# Altium project PROC114E3_SCH.PrjPcb (part 20 of 22)

## Sheet 40.SchDoc
size 513 x 386 mm
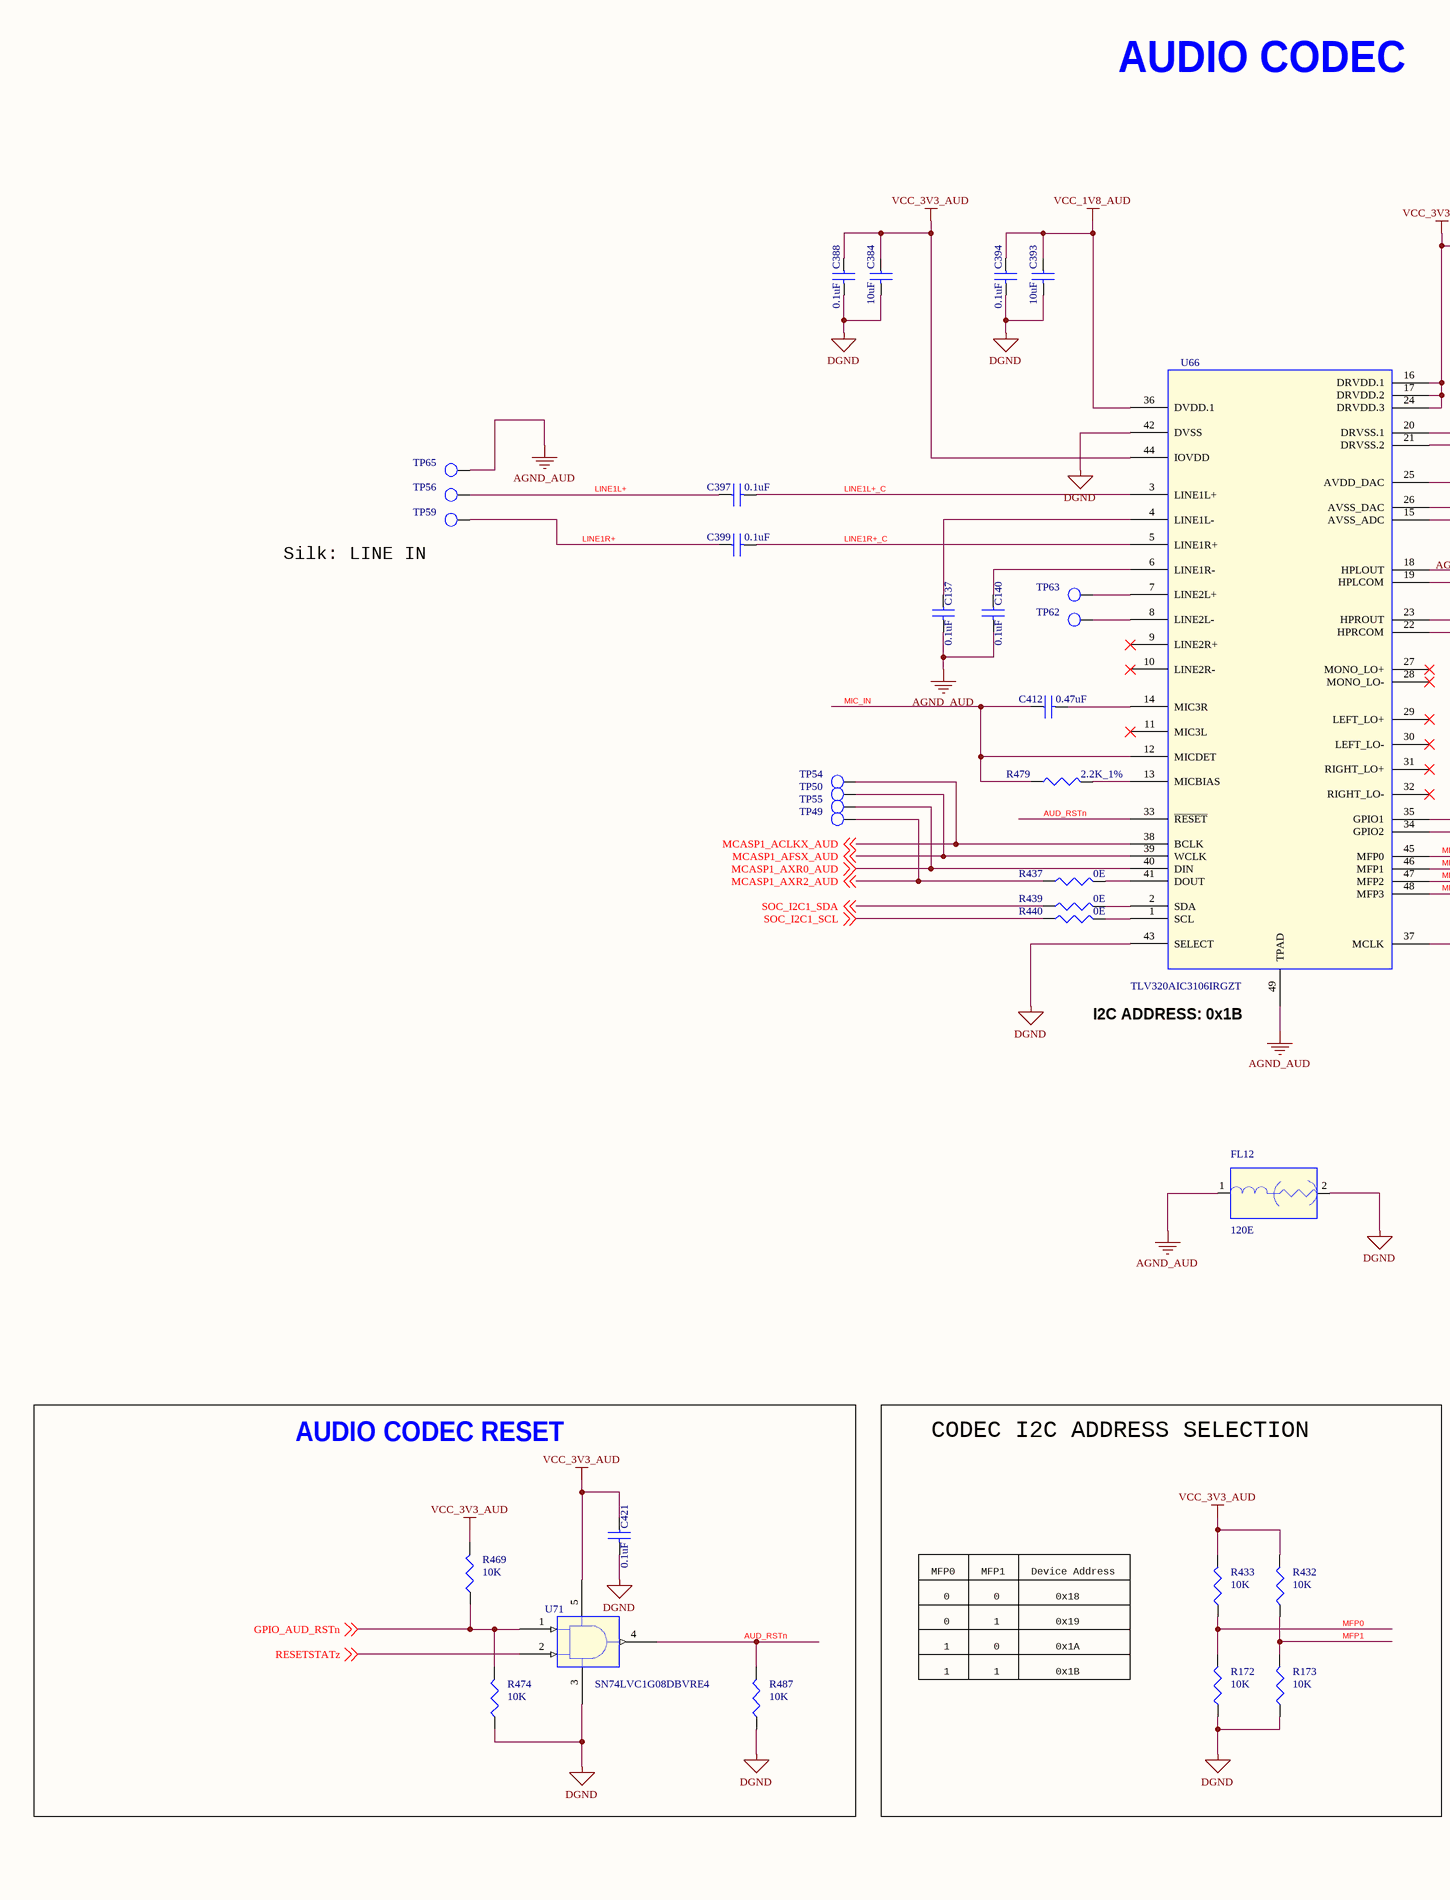
[diagram p71: 40.SchDoc, left]
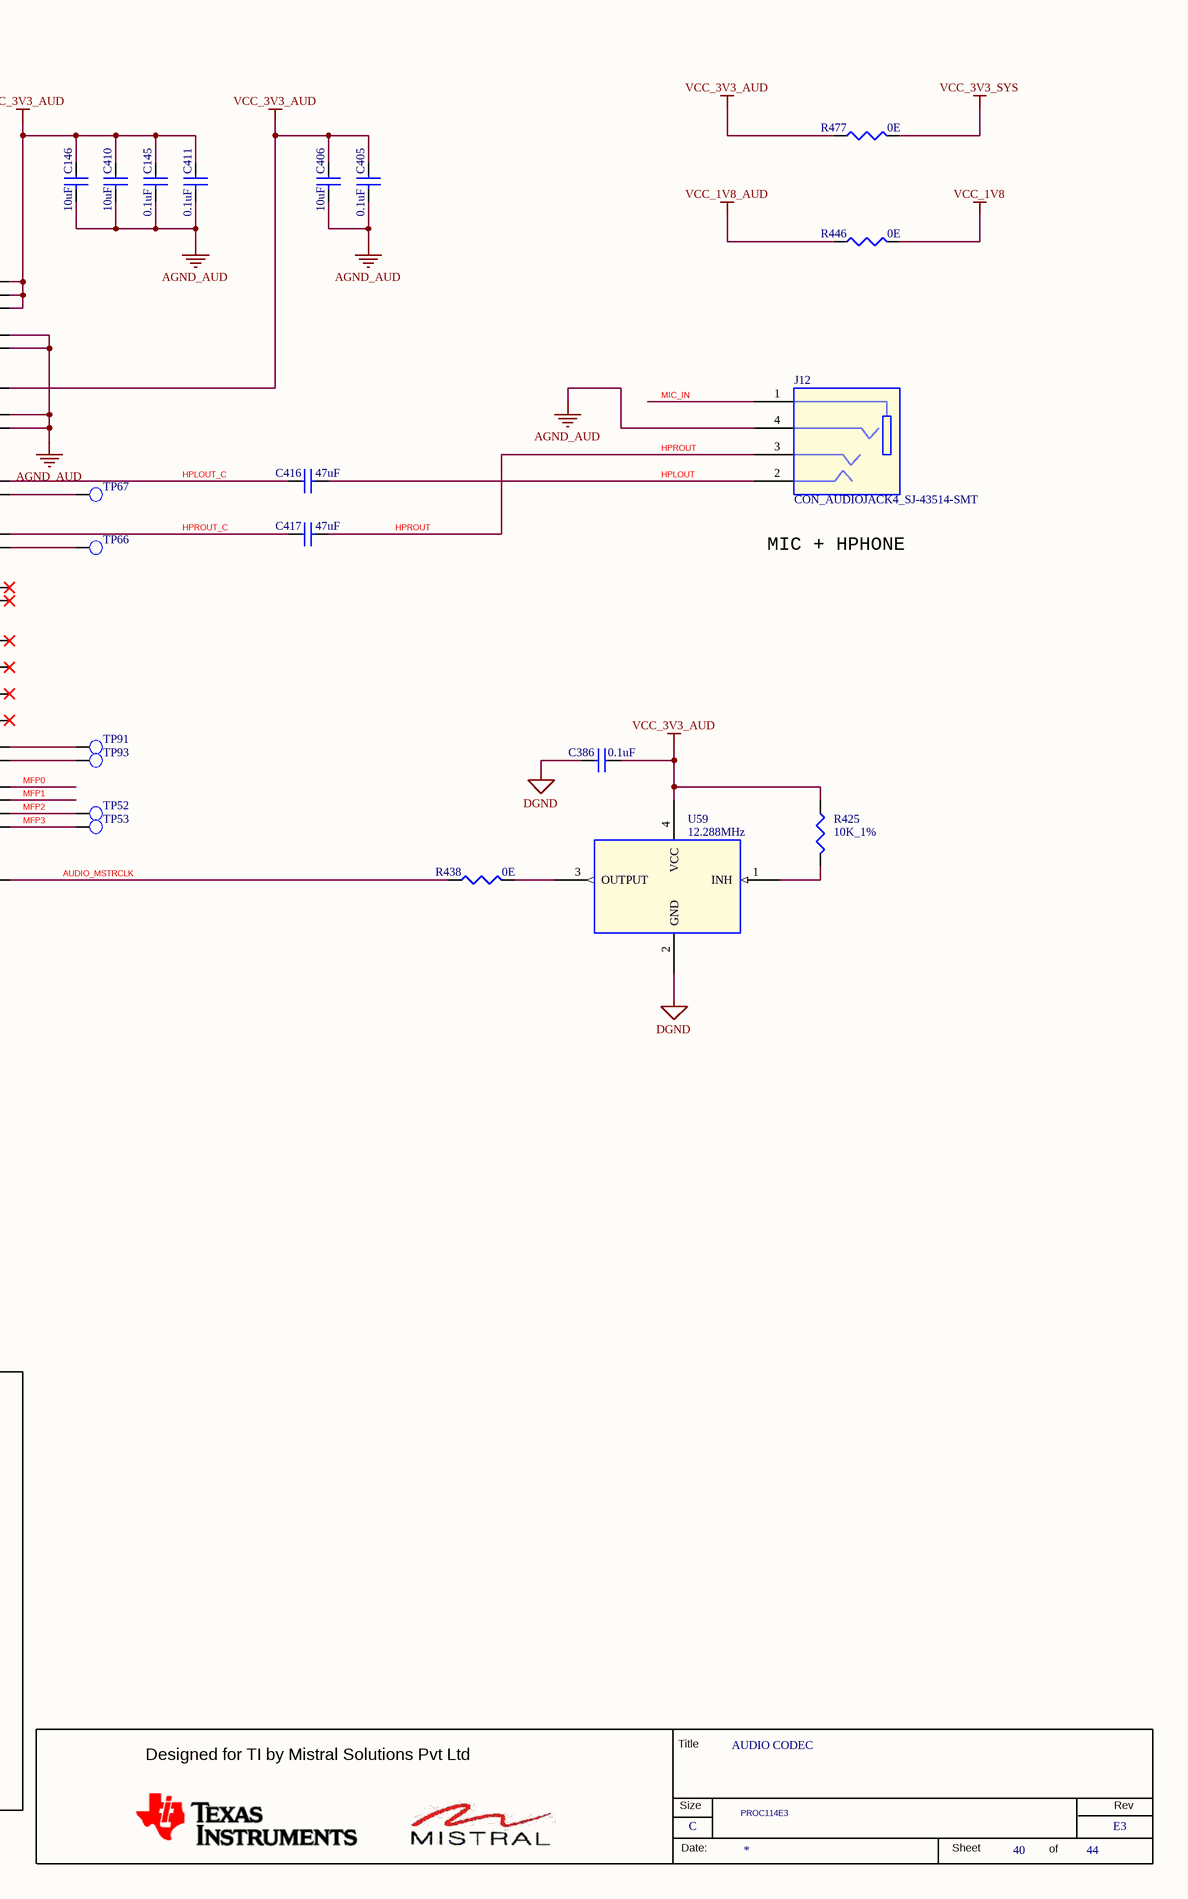
[diagram p72: 40.SchDoc, right]

### Parts
(Parts that share a designator on the sheet are numbered #1, #2 ... from top to bottom, then left to right.)
*#40  RevCode: E3  Title: AUDIO CODEC  Page Size: C  Page Number: 40  Page Count: 44  Variant Name: PROC114E3  (hidden comment: MISTRAL_TITLEBLK_CSIZE)  (graphical)
C137  0.1uF  [CAP0201_0-5]
C140  0.1uF  [CAP0201_0-5]
C145  0.1uF  [CAP0201_0-5]
C146  10uF  [CAP0402_0-75]
C384  10uF  [CAP0402_0-75]
C386  0.1uF  [CAP0201_0-5]
C388  0.1uF  [CAP0201_0-5]
C393  10uF  [CAP0402_0-75]
C394  0.1uF  [CAP0201_0-5]
C397  0.1uF  [CAP0402_0-75]
C399  0.1uF  [CAP0402_0-75]
C405  0.1uF  [CAP0201_0-5]
C406  10uF  [CAP0402_0-75]
C410  10uF  [CAP0402_0-75]
C411  0.1uF  [CAP0201_0-5]
C412  0.47uF  [CAP0402_0-75]
C416  47uF  [CAP1206_2]
C417  47uF  [CAP1206_2]
C421  0.1uF  [CAP0402_0-75]
FL12  120E  [EMIFIL_BLM15A_0402_0-6]
J12  CON_AUDIOJACK4_SJ-43514-SMT  [CON_AV4_SJ-43514-SMT_S_R_S_5-1]
R172  10K  [RES0201_0-5]
R173  10K  [RES0201_0-5]
R425  10K_1%  [RES0201_0-5]
R432  10K  [RES0201_0-5]
R433  10K  [RES0201_0-5]
R437  0E  [RES0201_0-5]
R438  0E  [RES0201_0-5]
R439  0E  [RES0201_0-5]
R440  0E  [RES0201_0-5]
R446  0E  [RES0201_0-5]
R469  10K  [RES0201_0-5]
R474  10K  [RES0201_0-5]
R477  0E  [RES0201_0-5]
R479  2.2K_1%  [RES0201_0-5]
R487  10K  [RES0201_0-5]
TP49  TP20_SMD  [TP20_SMD]  (value not drawn)
TP50  TP20_SMD  [TP20_SMD]  (value not drawn)
TP52  TP20_SMD  [TP20_SMD]  (value not drawn)
TP53  TP20_SMD  [TP20_SMD]  (value not drawn)
TP54  TP20_SMD  [TP20_SMD]  (value not drawn)
TP55  TP20_SMD  [TP20_SMD]  (value not drawn)
TP56  THRU HOLE  [TP_40X65]  (value not drawn)
TP59  THRU HOLE  [TP_40X65]  (value not drawn)
TP62  TP20_SMD  [TP20_SMD]  (value not drawn)
TP63  TP20_SMD  [TP20_SMD]  (value not drawn)
TP65  THRU HOLE  [TP_40X65]  (value not drawn)
TP66  TP20_SMD  [TP20_SMD]  (value not drawn)
TP67  TP20_SMD  [TP20_SMD]  (value not drawn)
TP91  TP20_SMD  [TP20_SMD]  (value not drawn)
TP93  TP20_SMD  [TP20_SMD]  (value not drawn)
U59  12.288MHz  [OSC4_KC2520B_100X80_SMD_0-8]
U66  TLV320AIC3106IRGZT  [VQFN48_19-68_285X285]
U71  SN74LVC1G08DBVRE4  [SOT23-5]

### Blocks framed on the sheet
AUDIO CODEC RESET: C421 R469 R474 R487 U71
CODEC I2C ADDRESS SELECTION: R172 R173 R432 R433

### Nets
AGND_AUD: C137.2 C140.2 C145.2 C146.2 C405.2 C406.2 C410.2 C411.2 FL12.1 J12.4 TP65.1(TP) U66.15(AVSS_ADC) U66.20(DRVSS.1) U66.21(DRVSS.2) U66.26(AVSS_DAC) U66.49(TPAD)
DGND: C384.2 C386.2 C388.2 C393.2 C394.2 C421.2 FL12.2 R172.2 R173.2 R474.1 R487.1 U59.2(GND) U66.42(DVSS) U66.43(SELECT) U71.3(GND)
VCC_1V8: R446.2
VCC_1V8_AUD: C393.1 C394.1 R446.1 U66.36(DVDD.1)
VCC_3V3_AUD: C145.1 C146.1 C384.1 C386.1 C388.1 C405.1 C406.1 C410.1 C411.1 C421.1 R425.1 R432.1 R433.1 R469.2 R477.1 U59.4(VCC) U66.16(DRVDD.1) U66.17(DRVDD.2) U66.24(DRVDD.3) U66.25(AVDD_DAC) U66.44(IOVDD) U71.5(VCC)
VCC_3V3_SYS: R477.2
AUD_RSTn: R487.2 U66.33(~{RESET}) U71.4(Y)
AUDIO_MSTRCLK: R438.1 U66.37(MCLK)
GPIO_AUD_RSTn: R469.1 R474.2 U71.1(A) ; off-sheet GPIO_AUD_RSTn
HPLOUT: C416.2 J12.2
HPLOUT_C: C416.1 U66.18(HPLOUT)
HPROUT: C417.2 J12.3
HPROUT_C: C417.1 U66.23(HPROUT)
LINE1L+: C397.1 TP56.1(TP)
LINE1L+_C: C397.2 U66.3(LINE1L+)
LINE1R+: C399.1 TP59.1(TP)
LINE1R+_C: C399.2 U66.5(LINE1R+)
MCASP1_ACLKX_AUD: TP54.1(TP) U66.38(BCLK) ; off-sheet MCASP1_ACLKX_AUD
MCASP1_AFSX_AUD: TP50.1(TP) U66.39(WCLK) ; off-sheet MCASP1_AFSX_AUD
MCASP1_AXR0_AUD: TP55.1(TP) U66.40(DIN) ; off-sheet MCASP1_AXR0_AUD
MCASP1_AXR2_AUD: R437.1 TP49.1(TP) ; off-sheet MCASP1_AXR2_AUD
MFP0: R172.1 R433.2 U66.45(MFP0)
MFP1: R173.1 R432.2 U66.46(MFP1)
MFP2: TP52.1(TP) U66.47(MFP2)
MFP3: TP53.1(TP) U66.48(MFP3)
MIC_IN: C412.1 J12.1 R479.1 U66.12(MICDET)
RESETSTATz: U71.2(B) ; off-sheet RESETSTATz
SoC_I2C1_SCL: R440.1 ; off-sheet SOC_I2C1_SCL
SoC_I2C1_SDA: R439.1 ; off-sheet SOC_I2C1_SDA
NetC137_1: C137.1 U66.4(LINE1L-)
NetC140_1: C140.1 U66.6(LINE1R-)
NetC412_2: C412.2 U66.14(MIC3R)
NetR425_2: R425.2 U59.1(INH)
NetR437_2: R437.2 U66.41(DOUT)
NetR438_2: R438.2 U59.3(OUTPUT)
NetR439_2: R439.2 U66.2(SDA)
NetR440_2: R440.2 U66.1(SCL)
NetR479_2: R479.2 U66.13(MICBIAS)
NetTP62_1: TP62.1(TP) U66.8(LINE2L-)
NetTP63_1: TP63.1(TP) U66.7(LINE2L+)
NetTP66_1: TP66.1(TP) U66.22(HPRCOM)
NetTP67_1: TP67.1(TP) U66.19(HPLCOM)
NetTP91_1: TP91.1(TP) U66.35(GPIO1)
NetTP93_1: TP93.1(TP) U66.34(GPIO2)

Not connected (* = marked no-connect by the designer): U66 9(LINE2R+)* 10(LINE2R-)* 11(MIC3L)* 27(MONO_LO+)* 28(MONO_LO-)* 29(LEFT_LO+)* 30(LEFT_LO-)* 31(RIGHT_LO+)* 32(RIGHT_LO-)*

### Notes on the sheet
- AUDIO CODEC
- Silk: LINE IN
- MIC + HPHONE
- (near U66) I2C ADDRESS: 0x1B
- MFP0
- MFP1
- Device Address
- 0
- 1
- 0x18
- 0x19
- 0x1A
- 0x1B
- (in symbol MISTRAL_TITLEBLK_CSIZE) Title; Designed for TI by Mistral Solutions Pvt Ltd; Size; Rev; Date:; Sheet; of

### Library data of the parts
*#40 = MISTRAL_TITLEBLK_CSIZE: Issue: 1.0; Page Create Date: March  8, 1995; Page Modify Date: *; Schematic Page Count: 44; Schematic Page Number: 40
C137 C140 C386 C388 C394 C405 C411 = CAP_Dup2: CAP CERAMIC 0.1uF 16V 10% X5R 0201; Part_type: CAPACITORS\CERAMIC; Mfr_part_number: GRM033R61C104KE14D; Mfr_name: MURATA; Mistral Part No: 120009030072-R; Custom_Duty: 15%; Customs_HS_Code: 85322990; Wattage: NA; Project: TI_MAXIE_CPB; PCB Footprint: CAP0201_0-5; Footprint Path: Y:\MIS_DATABASE\Library\ALTIUM_TOOL\PCB_FOOTPRINTS\Altium_Footprint_Lib.PcbLib; Library Path: Y:\MIS_DATABASE\Library\ALTIUM_TOOL\SCHEMATICS_PARTS\MS_DISCRETE_Library.schlib; MECHANICAL 3D STEP FILE: CAP0201_0-5; Chkd/date: MANIRAJA/230118; Crtd /date: MANIRAJA/230118; Datasheet: Y:\MIS_DATABASE\DATASHEETS\CAPACITORS\GRM033R61C104KE14.PDF; Temperature: -55°C+85°C; Weight: 0.33mg; Height: 0.33MM; Library Ref: CAP; Distributor_part_number: 490-14305-1-ND; Distributor_name: DIGIKEY; Package: 0201; Voltage: 16V; Tolerance: 10%; Footprint Ref: CAP0201_0-5
C145 = CAP_Dup2: CAP CERAMIC 0.1uF 16V 10% X5R 0201; Mistral Part No: 120009030072-R; Mfr_name: MURATA; Mfr_part_number: GRM033R61C104KE14D; Part_type: CAPACITORS\CERAMIC; Project: TI_MAXIE_CPB; Wattage: NA; Customs_HS_Code: 85322990; Custom_Duty: 15%; Footprint Ref: CAP0201_0-5; Tolerance: 10%; Voltage: 16V; Package: 0201; Distributor_name: DIGIKEY; Distributor_part_number: 490-14305-1-ND; Library Ref: CAP; Height: 0.33MM; Weight: 0.33mg; Temperature: -55°C+85°C; Datasheet: Y:\MIS_DATABASE\DATASHEETS\CAPACITORS\GRM033R61C104KE14.PDF; Crtd /date: MANIRAJA/230118; Chkd/date: MANIRAJA/230118; MECHANICAL 3D STEP FILE: CAP0201_0-5; Library Path: Y:\MIS_DATABASE\Library\ALTIUM_TOOL\SCHEMATICS_PARTS\MS_DISCRETE_Library.schlib; Footprint Path: Y:\MIS_DATABASE\Library\ALTIUM_TOOL\PCB_FOOTPRINTS\Altium_Footprint_Lib.PcbLib; PCB Footprint: CAP0201_0-5
C146 C384 C393 C406 C410 = CAP_Dup2: CAP CERAMIC 10uF 10V 20% X5R 0402; Part_type: CAPACITORS\CERAMIC; Mfr_part_number: GRM155R61A106ME11D; Mfr_name: MURATA; Mistral Part No: 120013110019-R; Custom_Duty: 15%; Customs_HS_Code: 85322990; Wattage: NA; Project: QCS610_NANOSOM; PCB Footprint: CAP0402_0-75; Footprint Path: Y:\MIS_DATABASE\Library\ALTIUM_TOOL\PCB_FOOTPRINTS\Altium_Footprint_Lib.PcbLib; Library Path: Y:\MIS_DATABASE\Library\ALTIUM_TOOL\SCHEMATICS_PARTS\MS_DISCRETE_Library.schlib; MECHANICAL 3D STEP FILE: CAP0402_0-75; Chkd/date: MANIRAJA/300520; Crtd /date: ALVY/260520; Datasheet: Y:\MIS_DATABASE\DATASHEETS\CAPACITORS\MURATA-GXX-SER_NOV17.PDF; Temperature: -55°C+85°C; Weight: 3.1mg; Height: 0.55MM; Footprint Ref: CAP0402_0-75; Library Ref: CAP; Distributor_part_number: 490-GRM155R61A106ME11DTR-ND; Distributor_name: DIGIKEY; Package: 0402; Voltage: 10V; Tolerance: 20%
C397 C421 = CAP_Dup2: CAP CERAMIC 0.1uF 50V 10% X7R 0402; Mistral Part No: 120011100014-R; Mfr_name: MURATA; Mfr_part_number: GRM155R71H104KE14D; Part_type: CAPACITORS\CERAMIC; Project: J7_CP; Wattage: NA; Customs_HS_Code: 85322990; Custom_Duty: 15%; PCB Footprint: CAP0402_0-75; Tolerance: 10%; Voltage: 50V; Package: 0402; Distributor_name: DIGIKEY; Distributor_part_number: 490-10700-1-ND; Library Ref: CAP; Footprint Ref: CAP0402_0-75; Height: 0.55MM; Weight: 3.1mg; Temperature: -55°C+125°C; Datasheet: Y:\MIS_DATABASE\DATASHEETS\CAPACITORS\GRM155R71H104KE14.PDF; Crtd /date: ALVY/211020; Chkd/date: MANIRAJA/261020; MECHANICAL 3D STEP FILE: CAP0402_0-75; Library Path: Y:\MIS_DATABASE\Library\ALTIUM_TOOL\SCHEMATICS_PARTS\MS_DISCRETE_Library.schlib; Footprint Path: Y:\MIS_DATABASE\Library\ALTIUM_TOOL\PCB_FOOTPRINTS\Altium_Footprint_Lib.PcbLib
C399 = CAP_Dup2: CAP CERAMIC 0.1uF 50V 10% X7R 0402; Part_type: CAPACITORS\CERAMIC; Mfr_part_number: GRM155R71H104KE14D; Mfr_name: MURATA; Mistral Part No: 120011100014-R; Custom_Duty: 15%; Customs_HS_Code: 85322990; Wattage: NA; Project: J7_CP; PCB Footprint: CAP0402_0-75; Footprint Path: Y:\MIS_DATABASE\Library\ALTIUM_TOOL\PCB_FOOTPRINTS\Altium_Footprint_Lib.PcbLib; Library Path: Y:\MIS_DATABASE\Library\ALTIUM_TOOL\SCHEMATICS_PARTS\MS_DISCRETE_Library.schlib; MECHANICAL 3D STEP FILE: CAP0402_0-75; Chkd/date: MANIRAJA/261020; Crtd /date: ALVY/211020; Datasheet: Y:\MIS_DATABASE\DATASHEETS\CAPACITORS\GRM155R71H104KE14.PDF; Temperature: -55°C+125°C; Weight: 3.1mg; Height: 0.55MM; Footprint Ref: CAP0402_0-75; Library Ref: CAP; Distributor_part_number: 490-10700-1-ND; Distributor_name: DIGIKEY; Package: 0402; Voltage: 50V; Tolerance: 10%
C412 = CAP_Dup2: CAP CERAMIC 0.47uF 10V 10% X7R 0402; Part_type: CAPACITORS\CERAMIC; Mfr_part_number: GRM155R71A474KE01D; Mfr_name: MURATA; Mistral Part No: 120021060019-R; Custom_Duty: 15%; Customs_HS_Code: 85322990; Wattage: NA; Project: TI_AM335x SK_BRD; PCB Footprint: CAP0402_0-75; Footprint Path: Y:\MIS_DATABASE\Library\ALTIUM_TOOL\PCB_FOOTPRINTS\Altium_Footprint_Lib.PcbLib; Library Path: Y:\MIS_DATABASE\Library\ALTIUM_TOOL\SCHEMATICS_PARTS\MS_DISCRETE_Library.schlib; MECHANICAL 3D STEP FILE: CAP0402_0-75; Chkd/date: MANIRAJA/310821; Crtd /date: ALVY/310821; Datasheet: Y:\MIS_DATABASE\DATASHEETS\CAPACITORS\GRM155R71A474KE01.PDF; Temperature: -55°C+125°C; Weight: 1.5mg; Height: 0.55MM; Library Ref: CAP; Distributor_part_number: 490-14366-1-ND; Distributor_name: DIGIKEY; Package: 0402; Voltage: 10V; Tolerance: 10%; Footprint Ref: CAP0402_0-75
C416 C417 = CAP_Dup2: CAP CERAMIC 47uF 10V 20% X5R 1206; Part_type: CAPACITORS\CERAMIC; Mfr_part_number: GRM31CR61A476ME15L; Mfr_name: MURATA; Mistral Part No: 120013120015-R; Custom_Duty: 15%; Customs_HS_Code: 85322990; Wattage: NA; Project: DMP; Footprint Path: Y:\MIS_DATABASE\Library\ALTIUM_TOOL\PCB_FOOTPRINTS\Altium_Footprint_Lib.PcbLib; Library Path: Y:\MIS_DATABASE\Library\ALTIUM_TOOL\SCHEMATICS_PARTS\MS_DISCRETE_Library.schlib; MECHANICAL 3D STEP FILE: CAP1206_2; Chkd/date: USMAN/121213; Crtd /date: USMAN/121213; Datasheet: Y:\MIS_DATABASE\DATASHEETS\CAPACITORS\MURATA-GXX-SER_NOV17.PDF; Temperature: -55°C+85°C; Weight: 40mg; Height: 1.80MM; Footprint Ref: CAP1206_2; Library Ref: CAP; Distributor_part_number: 490-5528-1-ND; Distributor_name: DIGIKEY; Package: 1206; Voltage: 10V; Tolerance: 20%; PCB Footprint: CAP1206_2
FL12 = EMIFILTER_IND: as FL10 on sheet 37; PCB Footprint: EMIFIL_BLM15A_0402_0-6; Footprint Ref: EMIFIL_BLM15A_0402_0-6; Wattage: NA; Package: 0402; Distributor_name: DIGIKEY; Distributor_part_number: 490-9656-1-ND; Library Ref: EMIFILTER_IND; Height: 0.55MM; Weight: 1mg; Temperature: -55°C+125°C; Datasheet: Y:\MIS_DATABASE\DATASHEETS\DISCRETES\INDUCTORS\BLM15-SN1-SER.PDF; Crtd /date: USMAN/170613; Chkd/date: NAVEED/241114; MECHANICAL 3D STEP FILE: EMIFIL_BLM15A_0402_0-6; Library Path: Y:\MIS_DATABASE\Library\ALTIUM_TOOL\SCHEMATICS_PARTS\MS_FILTER_Library.schlib; Footprint Path: Y:\MIS_DATABASE\Library\ALTIUM_TOOL\PCB_FOOTPRINTS\Altium_Footprint_Lib.PcbLib
J12 = CON_AUDIOJACK4_SJ-43514-SMT: CON AUDIO JACK 4POS FEMALE RT SMD; Mistral Part No: 150010060028-R; Mfr_name: CUI INC; Mfr_part_number: SJ-43514-SMT-TR; Part_type: CONNECTOR\JACK; Project: PB_BUGBASE; Tolerance: NA; Customs_HS_Code: 85369090; Custom_Duty: 24%; Footprint Ref: CON_AV4_SJ-43514-SMT_S_R_S_5-1; Voltage: NA; Wattage: NA; Package: SMD; Distributor_name: DIGIKEY; Distributor_part_number: CP-43514SJCT-ND; Library Ref: CON_AUDIOJACK4_SJ-43514-SMT; Height: 5.10MM; Weight: 1100mg; Temperature: -25°C+85°C; Datasheet: Y:\MIS_DATABASE\DATASHEETS\CONNECTORS\SJ-4351X-SMT.PDF; Crtd /date: MUDDU/300610; Chkd/date: MAZHAR/230211; MECHANICAL 3D STEP FILE: CON_AV4_SJ-43514-SMT_S_R_S_5-1; Library Path: Y:\MIS_DATABASE\Library\ALTIUM_TOOL\SCHEMATICS_PARTS\MS_CONNECTOR_Library.schlib; Footprint Path: Y:\MIS_DATABASE\Library\ALTIUM_TOOL\PCB_FOOTPRINTS\Altium_Footprint_Lib.PcbLib; PCB Footprint: CON_AV4_SJ-43514-SMT_S_R_S_5-1
R172 R173 R432 R433 = RESISTOR_Dup6: as R16 on sheet 37; Footprint Path: Y:\MIS_DATABASE\Library\ALTIUM_TOOL\PCB_FOOTPRINTS\Altium_Footprint_Lib.PcbLib; Library Path: Y:\MIS_DATABASE\Library\ALTIUM_TOOL\SCHEMATICS_PARTS\MS_DISCRETE_Library.schlib; MECHANICAL 3D STEP FILE: RES0201_0-5; Chkd/date: MANIRAJA/050517; Crtd /date: MANIRAJA/050517; Datasheet: Y:\MIS_DATABASE\DATASHEETS\RESISTORS\RCXXXXL-SER_MAR18.PDF; Temperature: -55°C+125°C; Weight: 0.17mg; Height: 0.26MM; Library Ref: RESISTOR; Distributor_part_number: 311-10KNCT-ND; Distributor_name: DIGIKEY; Package: 0201; Wattage: 1/20W; Tolerance: 5%; Footprint Ref: RES0201_0-5; PCB Footprint: RES0201_0-5
R425 = RESISTOR_Dup1: RES 10K 1/20W 1% 0201; Mistral Part No: 110011040018-R; Mfr_name: YAGEO AMERICA; Mfr_part_number: RC0201FR-0710KL; Part_type: RESISTORS\FIXED; Project: GOLDEN-I LITE; Voltage: NA; Customs_HS_Code: 85332119; Custom_Duty: 15%; PCB Footprint: RES0201_0-5; Tolerance: 1%; Wattage: 1/20W; Package: 0201; Distributor_name: DIGIKEY; Distributor_part_number: 311-10.0KMCT-ND; Library Ref: RESISTOR; Footprint Ref: RES0201_0-5; Height: 0.26MM; Weight: 0.17mg; Temperature: -55°C+125°C; Datasheet: Y:\MIS_DATABASE\DATASHEETS\RESISTORS\RCXXXXL-SER_MAR18.PDF; Crtd /date: MANIRAJA/270117; Chkd/date: VASANTHA/270117; MECHANICAL 3D STEP FILE: RES0201_0-5; Library Path: Y:\MIS_DATABASE\Library\ALTIUM_TOOL\SCHEMATICS_PARTS\MS_DISCRETE_Library.schlib; Footprint Path: Y:\MIS_DATABASE\Library\ALTIUM_TOOL\PCB_FOOTPRINTS\Altium_Footprint_Lib.PcbLib
R437 = RESISTOR_Dup1: RES 0E 1/20W 5% 0201; Part_type: RESISTORS\FIXED; Mfr_part_number: RC0201JR-070RL; Mfr_name: YAGEO AMERICA; Mistral Part No: 110010070067-R; Custom_Duty: 15%; Customs_HS_Code: 85332119; Voltage: NA; Project: PB_BUGBASE; SIGNAL_MODEL: RESISTOR_RES0201_0-5_0E_0E; Footprint Path: Y:\MIS_DATABASE\Library\ALTIUM_TOOL\PCB_FOOTPRINTS\Altium_Footprint_Lib.PcbLib; Library Path: Y:\MIS_DATABASE\Library\ALTIUM_TOOL\SCHEMATICS_PARTS\MS_DISCRETE_Library.schlib; MECHANICAL 3D STEP FILE: RES0201_0-5; Chkd/date: NAVEED/301214; Crtd /date: MUDDU/120710; Datasheet: Y:\MIS_DATABASE\DATASHEETS\RESISTORS\RCXXXXL-SER_MAR18.PDF; Temperature: -55°C+125°C; Weight: 0.17mg; Height: 0.26MM; Footprint Ref: RES0201_0-5; Library Ref: RESISTOR; Distributor_part_number: 311-0.0NCT-ND; Distributor_name: DIGIKEY; Package: 0201; Wattage: 1/20W; Tolerance: 5%; PCB Footprint: RES0201_0-5
R438-R440 = RESISTOR_Dup1: RES 0E 1/20W 5% 0201; Part_type: RESISTORS\FIXED; Mfr_part_number: RC0201JR-070RL; Mfr_name: YAGEO AMERICA; Mistral Part No: 110010070067-R; Custom_Duty: 15%; Customs_HS_Code: 85332119; Voltage: NA; Project: PB_BUGBASE; PCB Footprint: RES0201_0-5; Footprint Path: Y:\MIS_DATABASE\Library\ALTIUM_TOOL\PCB_FOOTPRINTS\Altium_Footprint_Lib.PcbLib; Library Path: Y:\MIS_DATABASE\Library\ALTIUM_TOOL\SCHEMATICS_PARTS\MS_DISCRETE_Library.schlib; MECHANICAL 3D STEP FILE: RES0201_0-5; Chkd/date: NAVEED/301214; Crtd /date: MUDDU/120710; Datasheet: Y:\MIS_DATABASE\DATASHEETS\RESISTORS\RCXXXXL-SER_MAR18.PDF; Temperature: -55°C+125°C; Weight: 0.17mg; Height: 0.26MM; Footprint Ref: RES0201_0-5; Library Ref: RESISTOR; Distributor_part_number: 311-0.0NCT-ND; Distributor_name: DIGIKEY; Package: 0201; Wattage: 1/20W; Tolerance: 5%
R446 R477 = RESISTOR_Dup6: as R697 on sheet 39; PCB Footprint: RES0201_0-5; Footprint Path: Y:\MIS_DATABASE\Library\ALTIUM_TOOL\PCB_FOOTPRINTS\Altium_Footprint_Lib.PcbLib; Library Path: Y:\MIS_DATABASE\Library\ALTIUM_TOOL\SCHEMATICS_PARTS\MS_DISCRETE_Library.schlib; MECHANICAL 3D STEP FILE: RES0201_0-5; Chkd/date: NAVEED/301214; Crtd /date: MUDDU/120710; Datasheet: Y:\MIS_DATABASE\DATASHEETS\RESISTORS\RCXXXXL-SER_MAR18.PDF; Temperature: -55°C+125°C; Weight: 0.17mg; Height: 0.26MM; Library Ref: RESISTOR; Distributor_part_number: 311-0.0NCT-ND; Distributor_name: DIGIKEY; Package: 0201; Wattage: 1/20W; Tolerance: 5%; Footprint Ref: RES0201_0-5
R469 = RESISTOR_Dup1: RES 10K 1/20W 5% 0201; Part_type: RESISTORS\FIXED; Mfr_part_number: RC0201JR-0710KL; Mfr_name: YAGEO AMERICA; Mistral Part No: 110010070051-R; Custom_Duty: 15%; Customs_HS_Code: 85332119; Voltage: NA; Project: GOLDEN-I LITE; Footprint Path: Y:\MIS_DATABASE\Library\ALTIUM_TOOL\PCB_FOOTPRINTS\Altium_Footprint_Lib.PcbLib; Library Path: Y:\MIS_DATABASE\Library\ALTIUM_TOOL\SCHEMATICS_PARTS\MS_DISCRETE_Library.schlib; MECHANICAL 3D STEP FILE: RES0201_0-5; Chkd/date: MANIRAJA/050517; Crtd /date: MANIRAJA/050517; Datasheet: Y:\MIS_DATABASE\DATASHEETS\RESISTORS\RCXXXXL-SER_MAR18.PDF; Temperature: -55°C+125°C; Weight: 0.17mg; Height: 0.26MM; Library Ref: RESISTOR; Distributor_part_number: 311-10KNCT-ND; Distributor_name: DIGIKEY; Package: 0201; Wattage: 1/20W; Tolerance: 5%; Footprint Ref: RES0201_0-5; PCB Footprint: RES0201_0-5
R474 R487 = RESISTOR_Dup1: RES 10K 1/20W 5% 0201; Mistral Part No: 110010070051-R; Mfr_name: YAGEO AMERICA; Mfr_part_number: RC0201JR-0710KL; Part_type: RESISTORS\FIXED; Project: GOLDEN-I LITE; Voltage: NA; Customs_HS_Code: 85332119; Custom_Duty: 15%; Footprint Ref: RES0201_0-5; Tolerance: 5%; Wattage: 1/20W; Package: 0201; Distributor_name: DIGIKEY; Distributor_part_number: 311-10KNCT-ND; Library Ref: RESISTOR; Height: 0.26MM; Weight: 0.17mg; Temperature: -55°C+125°C; Datasheet: Y:\MIS_DATABASE\DATASHEETS\RESISTORS\RCXXXXL-SER_MAR18.PDF; Crtd /date: MANIRAJA/050517; Chkd/date: MANIRAJA/050517; MECHANICAL 3D STEP FILE: RES0201_0-5; Library Path: Y:\MIS_DATABASE\Library\ALTIUM_TOOL\SCHEMATICS_PARTS\MS_DISCRETE_Library.schlib; Footprint Path: Y:\MIS_DATABASE\Library\ALTIUM_TOOL\PCB_FOOTPRINTS\Altium_Footprint_Lib.PcbLib; PCB Footprint: RES0201_0-5
R479 = RESISTOR_Dup6: RES 2.2K 1/20W 1% 0201; Mistral Part No: 110017010016-R; Mfr_name: YAGEO AMERICA; Mfr_part_number: RC0201FR-072K2L; Part_type: RESISTORS\FIXED; Project: GOLDEN-I LITE; Voltage: NA; Customs_HS_Code: 85332119; Custom_Duty: 15%; PCB Footprint: RES0201_0-5; Footprint Ref: RES0201_0-5; Tolerance: 1%; Wattage: 1/20W; Package: 0201; Distributor_name: DIGIKEY; Distributor_part_number: YAG2572CT-ND; Library Ref: RESISTOR; Height: 0.26MM; Weight: 0.17mg; Temperature: -55°C+125°C; Datasheet: Y:\MIS_DATABASE\DATASHEETS\RESISTORS\RCXXXXL-SER_MAR18.PDF; Crtd /date: MANIRAJA/270117; Chkd/date: VASANTHA/270117; MECHANICAL 3D STEP FILE: RES0201_0-5; Library Path: Y:\MIS_DATABASE\Library\ALTIUM_TOOL\SCHEMATICS_PARTS\MS_DISCRETE_Library.schlib; Footprint Path: Y:\MIS_DATABASE\Library\ALTIUM_TOOL\PCB_FOOTPRINTS\Altium_Footprint_Lib.PcbLib
TP49 TP54 TP55 TP62 TP63 TP91 TP93 = TESTPOINT: TESTPOINT CIR 20 SMD; Mistral Part No: NA; Mfr_name: LOCAL; Project: BT MODULE_CSRBC04; PCB Footprint: TP20_SMD; RoHS: NA; Mfr_part_number: TP20_SMD; Part_type: TESTPOINT; Package: SMD; Distributor_name: NA; Distributor_part_number: NA; Height: NA; Crtd /date: MAZHAR/171006; Chkd/date: SHREESHAIL/171006; Tolerance: NA; Voltage: NA; Wattage: NA; Weight: NA; Temperature: NA; Datasheet: NA; MECHANICAL 3D STEP FILE: NA; Library Path: Y:\MIS_DATABASE\Library\ALTIUM_TOOL\SCHEMATICS_PARTS\MS_DISCRETE_Library.schlib; Footprint Path: Y:\MIS_DATABASE\Library\ALTIUM_TOOL\PCB_FOOTPRINTS\Altium_Footprint_Lib.PcbLib; Library Ref: TESTPOINT; Footprint Ref: TP20_SMD; Customs_HS_Code: NA; Custom_Duty: NA
TP50 TP52 TP53 TP66 TP67 = TESTPOINT: TESTPOINT CIR 20 SMD; Mfr_name: LOCAL; Custom_Duty: NA; Project: BT MODULE_CSRBC04; PCB Footprint: TP20_SMD; Customs_HS_Code: NA; Footprint Ref: TP20_SMD; Library Ref: TESTPOINT; Footprint Path: Y:\MIS_DATABASE\Library\ALTIUM_TOOL\PCB_FOOTPRINTS\Altium_Footprint_Lib.PcbLib; Library Path: Y:\MIS_DATABASE\Library\ALTIUM_TOOL\SCHEMATICS_PARTS\MS_DISCRETE_Library.schlib; MECHANICAL 3D STEP FILE: NA; Datasheet: NA; Temperature: NA; Weight: NA; Wattage: NA; Voltage: NA; Tolerance: NA; Chkd/date: SHREESHAIL/171006; Crtd /date: MAZHAR/171006; Height: NA; Distributor_part_number: NA; Distributor_name: NA; Package: SMD; Part_type: TESTPOINT; Mfr_part_number: TP20_SMD; Mistral Part No: NA; RoHS: NA
TP56 TP59 = TESTPOINT: TESTPOINT 1.0MM DRILL PTH; Mistral Part No: 130009030938; Mfr_name: LOCAL; Project: HSE; PCB Footprint: TP_40X65; Mfr_part_number: TP_40X65; Part_type: TESTPOINT; Package: THRU-HOLE; Distributor_name: NA; Distributor_part_number: NA; Height: NA; Crtd /date: SHREESHAIL/041005; Chkd/date: MAZHAR/271211; Datasheet: NA; Library Ref: TESTPOINT
TP65 = TESTPOINT: TESTPOINT 1.0MM DRILL PTH; Mfr_name: LOCAL; Mistral Part No: 130009030938; Project: HSE; PCB Footprint: TP_40X65; Library Ref: TESTPOINT; Datasheet: NA; Chkd/date: MAZHAR/271211; Crtd /date: SHREESHAIL/041005; Height: NA; Distributor_part_number: NA; Distributor_name: NA; Package: THRU-HOLE; Part_type: TESTPOINT; Mfr_part_number: TP_40X65
U59 = OSC_KC2016K: OSC 12.288MHz CMOS SMD; Part_type: OSCILLATORS; Mfr_part_number: KC2520Z12.2880C1KX00; Mfr_name: KYOCERA; Mistral Part No: 130021100008-R; Custom_Duty: 24%; Customs_HS_Code: 85437099; Wattage: NA; Project: TI_AM62x SKEVM_BRD; PCB Footprint: OSC4_KC2520B_100X80_SMD_0-8; Footprint Path: Y:\MIS_DATABASE\Library\ALTIUM_TOOL\PCB_FOOTPRINTS\Altium_Footprint_Lib.PcbLib; Library Path: Y:\MIS_DATABASE\Library\ALTIUM_TOOL\SCHEMATICS_PARTS\MS_DISCRETE_Library.schlib; MECHANICAL 3D STEP FILE: OSC4_KC2520B_100X80_SMD_0-8; Chkd/date: MANIRAJA/061021; Crtd /date: ALVY/061021; Datasheet: Y:\MIS_DATABASE\DATASHEETS\MISC\CRY_OSC\KC-Z-SERPDF; Temperature: -40°C+85°C; Weight: NA; Height: 0.80MM; Library Ref: OSC_KC2016K; Distributor_part_number: 1253-KC2520Z12.2880C1KX00CT-ND; Distributor_name: DIGIKEY; Package: SMD; Voltage: NA; Tolerance: NA; Footprint Ref: OSC4_KC2520B_100X80_SMD_0-8
U66 = TLV320AIC3106IRGZT_VQFN48: IC LOW-POWER STEREO AUDIO CODEC VQFN48; Part_type: ICS\TELECOM\CODEC; Mfr_name: TEXAS INSTRUMENTS; Mistral Part No: 143010060003-R; Custom_Duty: 15%; Customs_HS_Code: 85423100; Project: CENTAURUS; PCB Footprint: VQFN48_19-68_285X285; RoHS: Sb/ Br FREE; Chkd/date: SUHAS/261010; Crtd /date: MUDDU/150610; Datasheet: Y:\MIS_DATABASE\DATASHEETS\ICS\TELECOM\TLV320AIC3106IRGZT.PDF; Temperature: -40°C+85°C; Weight: NA; Height: 1.00MM; Library Ref: TLV320AIC3106IRGZT_VQFN48; Distributor_part_number: TLV320AIC3106IRGZT-ND; Distributor_name: DIGIKEY; Package: VQFN48; Mfr_part_number: TLV320AIC3106IRGZT
U71 = SN74LVC1G08DBVRE4_SOT23-5_Dup1: as U105 on sheet 37; RoHS: Sb/ Br FREE; Chkd/date: SUHAS/221010; Crtd /date: USMAN/151008; Datasheet: Y:\MIS_DATABASE\DATASHEETS\ICS\DIGITAL\GATES\SN74LVC1G08.PDF; Temperature: -40°C+85°C; Height: 1.45MM; Library Ref: SN74LVC1G08DBVRE4_SOT23-5; Distributor_part_number: SN74LVC1G08DBVRE4-ND; Distributor_name: DIGIKEY; Package: SOT23-5; Mfr_part_number: SN74LVC1G08DBVRE4; PCB Footprint: SOT23-5

## Sheet 41.SchDoc
size 513 x 386 mm
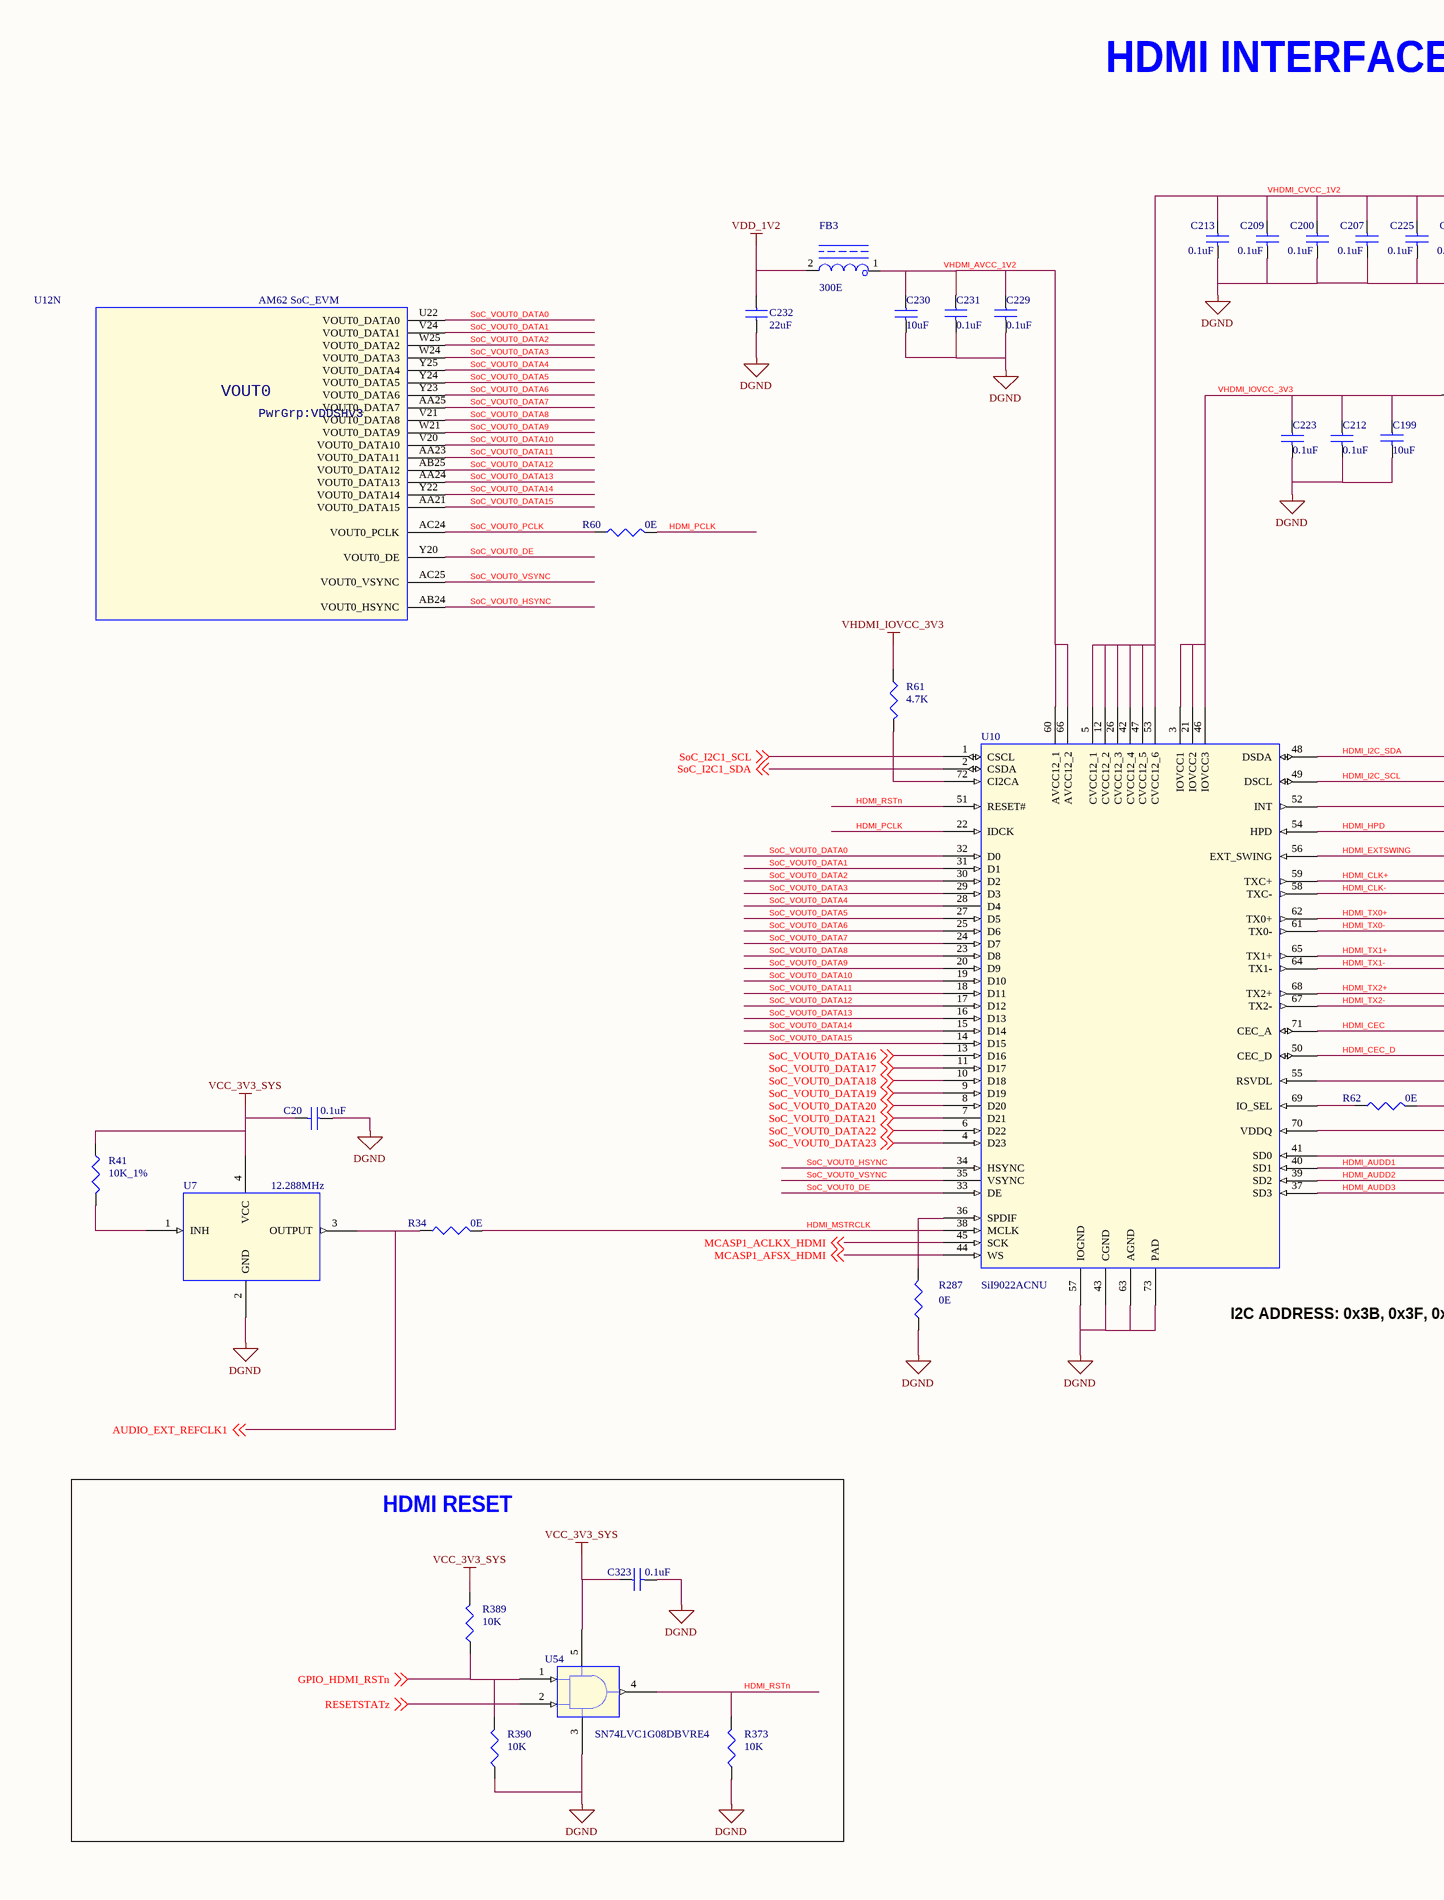
[diagram p73: 41.SchDoc, left]
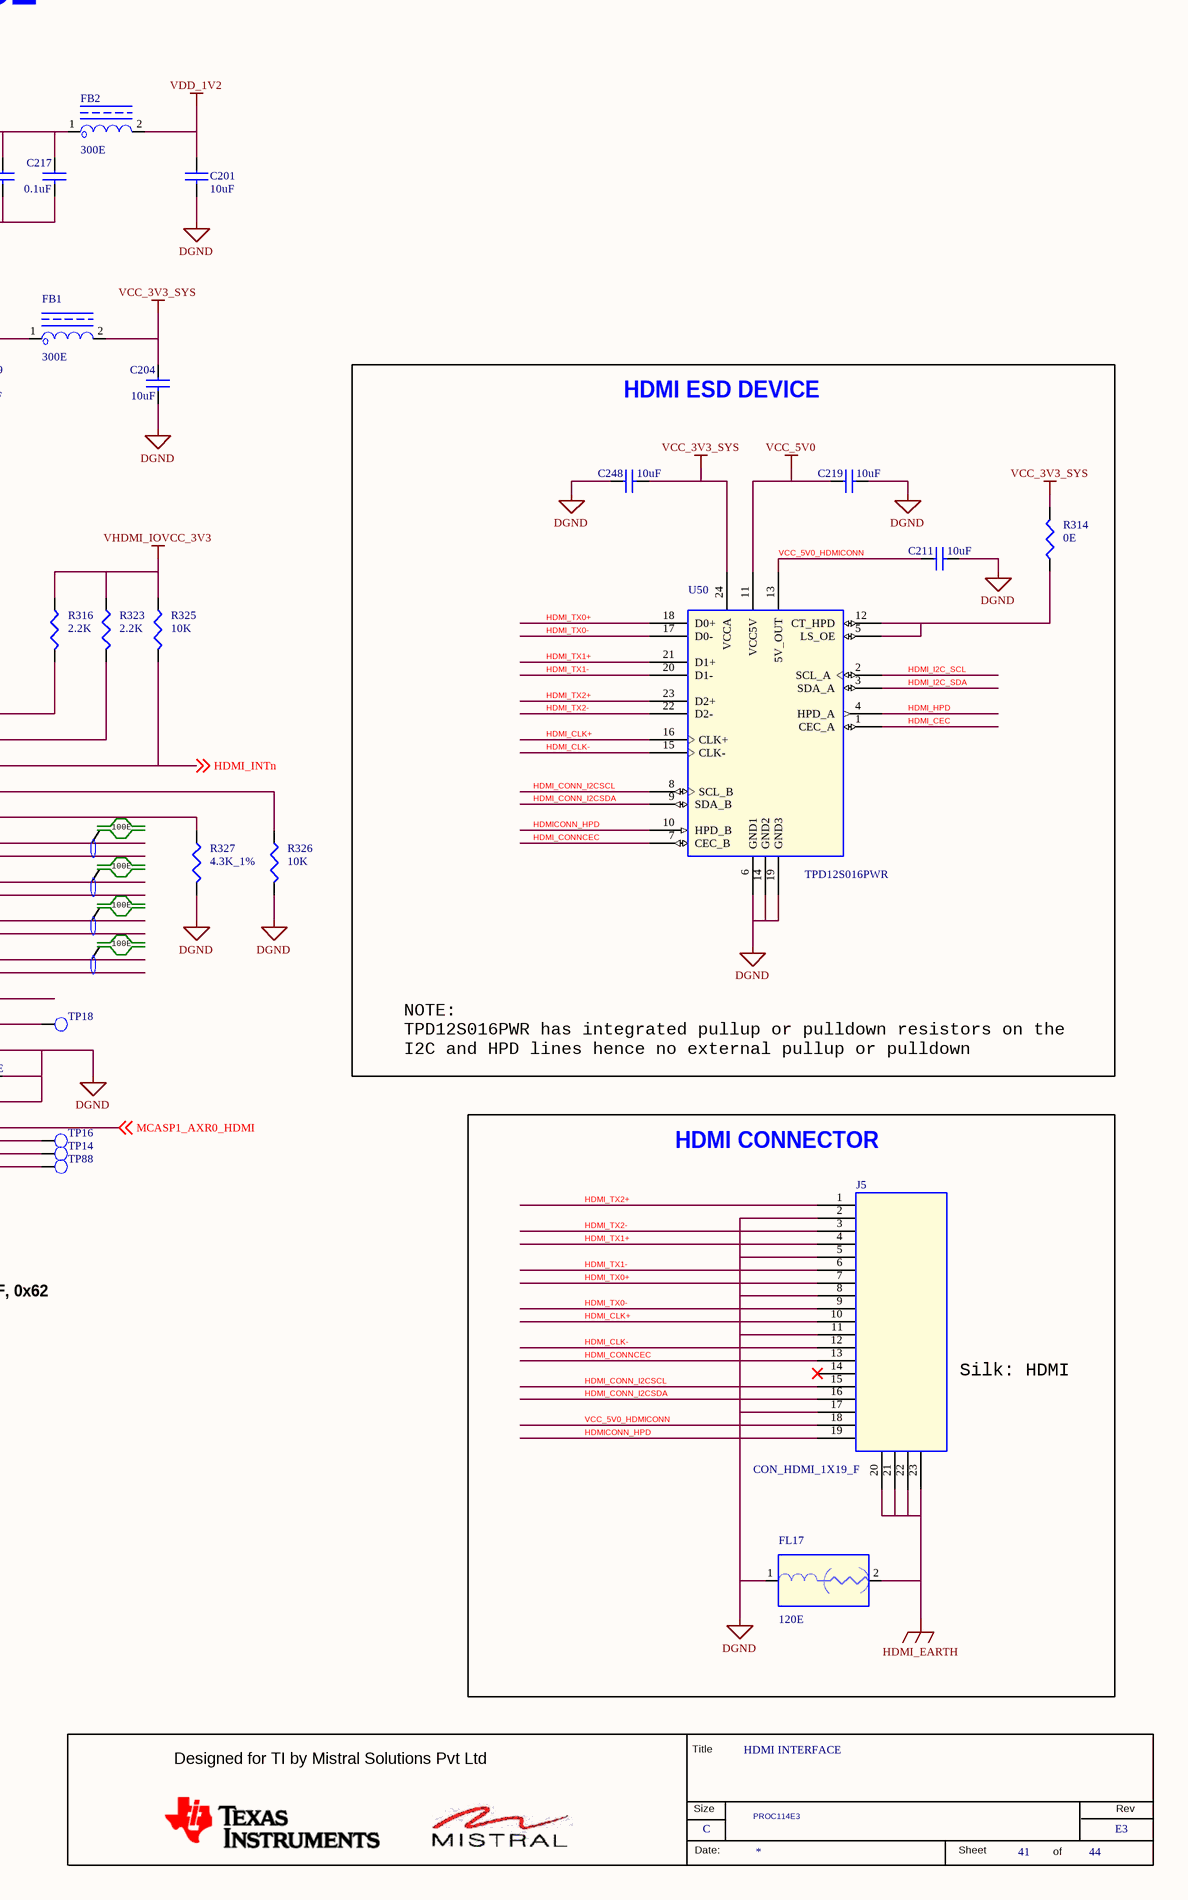
[diagram p74: 41.SchDoc, right]

### Parts
(Parts that share a designator on the sheet are numbered #1, #2 ... from top to bottom, then left to right.)
*#41  RevCode: E3  Title: HDMI INTERFACE  Page Size: C  Page Number: 41  Page Count: 44  Variant Name: PROC114E3  (hidden comment: MISTRAL_TITLEBLK_CSIZE)  (graphical)
C20  0.1uF  [CAP0201_0-5]
C199  10uF  [CAP0402_0-75]
C200  0.1uF  [CAP0201_0-5]
C201  10uF  [CAP0402_0-75]
C204  10uF  [CAP0402_0-75]
C207  0.1uF  [CAP0201_0-5]
C209  0.1uF  [CAP0201_0-5]
C211  10uF  [CAP0402_0-75]
C212  0.1uF  [CAP0201_0-5]
C213  0.1uF  [CAP0201_0-5]
C217  0.1uF  [CAP0201_0-5]
C219  10uF  [CAP0402_0-75]
C223  0.1uF  [CAP0201_0-5]
C225  0.1uF  [CAP0201_0-5]
C229  0.1uF  [CAP0201_0-5]
C230  10uF  [CAP0402_0-75]
C231  0.1uF  [CAP0201_0-5]
C232  22uF  [CAP0603_1]
C248  10uF  [CAP0402_0-75]
C323  0.1uF  [CAP0402_0-75]
FB1  300E  [IND0603]
FB2  300E  [IND0603]
FB3  300E  [IND0603]
FL17  120E  [EMIFIL_BLM15A_0402_0-6]
J5  CON_HDMI_1X19_F  [CON_19X1_10029449-001RLF_S_R_S_6-3]
R34  0E  [RES0201_0-5]
R41  10K_1%  [RES0201_0-5]
R60  0E  [RES0201_0-5]
R61  4.7K  [RES0201_0-5]
R62  0E  [RES0201_0-5]
R287  0E  [RES0201_0-5]
R314  0E  [RES0201_0-5]
R316  2.2K  [RES0402_0-5]
R323  2.2K  [RES0402_0-5]
R325  10K  [RES0201_0-5]
R326  10K  [RES0402_0-5]
R327  4.3K_1%  [RES0402_0-5]
R373  10K  [RES0201_0-5]
R389  10K  [RES0201_0-5]
R390  10K  [RES0201_0-5]
TP14  TP20_SMD  [TP20_SMD]  (value not drawn)
TP16  TP20_SMD  [TP20_SMD]  (value not drawn)
TP18  TP20_SMD  [TP20_SMD]  (value not drawn)
TP88  TP20_SMD  [TP20_SMD]  (value not drawn)
U7  12.288MHz  [OSC4_KC2520B_100X80_SMD_0-8]
U10  SiI9022ACNU  [QFN72_19-68_390X390_0-9]
U12#2  AM62 SoC_EVM  [BGA425_19-68_510X510_0-7]  (part N of 18)
U50  TPD12S016PWR  [TSSOP24_25-59_315X180_1-2]
U54  SN74LVC1G08DBVRE4  [SOT23-5]

### Blocks framed on the sheet
HDMI ESD DEVICE: C211 C219 C248 R314 U50
HDMI CONNECTOR: FL17 J5
HDMI RESET: C323 R373 R389 R390 U54

### Nets
DGND: C20.1 C199.2 C200.2 C201.2 C204.2 C207.2 C209.2 C211.2 C212.2 C213.2 C217.2 C219.2 C223.2 C225.2 C229.2 C230.2 C231.2 C232.2 C248.1 C323.2 FL17.1 J5.2 J5.5 J5.8 J5.11 J5.17 R62.2 R287.1 R326.2 R327.2 R373.1 R390.1 U7.2(GND) U10.43(CGND) U10.55(RSVDL) U10.57(IOGND) U10.63(AGND) U10.70(VDDQ) U10.73(PAD) U50.6(GND1) U50.14(GND2) U50.19(GND3) U54.3(GND)
HDMI_EARTH: FL17.2 J5.20 J5.21 J5.22 J5.23
VCC_3V3_SYS: C20.2 C204.1 C248.2 C323.1 FB1.2 R41.2 R314.2 R389.2 U7.4(VCC) U50.24(VCCA) U54.5(VCC)
VCC_5V0: C219.1 U50.11(VCC5V)
VDD_1V2: C201.1 C232.1 FB2.2 FB3.2
VHDMI_IOVCC_3V3: C199.1 C212.1 C223.1 FB1.1 R61.1 R316.1 R323.1 R325.1 U10.3(IOVCC1) U10.21(IOVCC2) U10.46(IOVCC3)
AUDIO_EXT_REFCLK1: R34.1 U7.3(OUTPUT) ; off-sheet AUDIO_EXT_REFCLK1
GPIO_HDMI_RSTn: R389.1 R390.2 U54.1(A) ; off-sheet GPIO_HDMI_RSTn
HDMI_AUDD1: TP16.1(TP) U10.40(SD1)
HDMI_AUDD2: TP14.1(TP) U10.39(SD2)
HDMI_AUDD3: TP88.1(TP) U10.37(SD3)
HDMI_CEC: U10.71(CEC_A) U50.1(CEC_A)
HDMI_CEC_D: TP18.1(TP) U10.50(CEC_D)
HDMI_CLK+: J5.10 U10.59(TXC+) U50.16(CLK+)
HDMI_CLK-: J5.12 U10.58(TXC-) U50.15(CLK-)
HDMI_CONN_I2CSCL: J5.15 U50.8(SCL_B)
HDMI_CONN_I2CSDA: J5.16 U50.9(SDA_B)
HDMI_CONNCEC: J5.13 U50.7(CEC_B)
HDMI_EXTSWING: R327.1 U10.56(EXT_SWING)
HDMI_HPD: R326.1 U10.54(HPD) U50.4(HPD_A)
HDMI_I2C_SCL: R323.2 U10.49(DSCL) U50.2(SCL_A)
HDMI_I2C_SDA: R316.2 U10.48(DSDA) U50.3(SDA_A)
HDMI_INTn: R325.2 U10.52(INT) ; off-sheet HDMI_INTn
HDMI_MSTRCLK: R34.2 U10.38(MCLK)
HDMI_PCLK: R60.2 U10.22(IDCK)
HDMI_RSTn: R373.2 U10.51(RESET#) U54.4(Y)
HDMI_TX0+: J5.7 U10.62(TX0+) U50.18(D0+)
HDMI_TX0-: J5.9 U10.61(TX0-) U50.17(D0-)
HDMI_TX1+: J5.4 U10.65(TX1+) U50.21(D1+)
HDMI_TX1-: J5.6 U10.64(TX1-) U50.20(D1-)
HDMI_TX2+: J5.1 U10.68(TX2+) U50.23(D2+)
HDMI_TX2-: J5.3 U10.67(TX2-) U50.22(D2-)
HDMICONN_HPD: J5.19 U50.10(HPD_B)
MCASP1_ACLKX_HDMI: U10.45(SCK) ; off-sheet MCASP1_ACLKX_HDMI
MCASP1_AFSX_HDMI: U10.44(WS) ; off-sheet MCASP1_AFSX_HDMI
MCASP1_AXR0_HDMI: U10.41(SD0) ; off-sheet MCASP1_AXR0_HDMI
RESETSTATz: U54.2(B) ; off-sheet RESETSTATz
SoC_I2C1_SCL: U10.1(CSCL) ; off-sheet SoC_I2C1_SCL
SoC_I2C1_SDA: U10.2(CSDA) ; off-sheet SoC_I2C1_SDA
SoC_VOUT0_DATA0: U10.32(D0) U12#2.U22(VOUT0_DATA0)
SoC_VOUT0_DATA1: U10.31(D1) U12#2.V24(VOUT0_DATA1)
SoC_VOUT0_DATA2: U10.30(D2) U12#2.W25(VOUT0_DATA2)
SoC_VOUT0_DATA3: U10.29(D3) U12#2.W24(VOUT0_DATA3)
SoC_VOUT0_DATA4: U10.28(D4) U12#2.Y25(VOUT0_DATA4)
SoC_VOUT0_DATA5: U10.27(D5) U12#2.Y24(VOUT0_DATA5)
SoC_VOUT0_DATA6: U10.25(D6) U12#2.Y23(VOUT0_DATA6)
SoC_VOUT0_DATA7: U10.24(D7) U12#2.AA25(VOUT0_DATA7)
SoC_VOUT0_DATA8: U10.23(D8) U12#2.V21(VOUT0_DATA8)
SoC_VOUT0_DATA9: U10.20(D9) U12#2.W21(VOUT0_DATA9)
SoC_VOUT0_DATA10: U10.19(D10) U12#2.V20(VOUT0_DATA10)
SoC_VOUT0_DATA11: U10.18(D11) U12#2.AA23(VOUT0_DATA11)
SoC_VOUT0_DATA12: U10.17(D12) U12#2.AB25(VOUT0_DATA12)
SoC_VOUT0_DATA13: U10.16(D13) U12#2.AA24(VOUT0_DATA13)
SoC_VOUT0_DATA14: U10.15(D14) U12#2.Y22(VOUT0_DATA14)
SoC_VOUT0_DATA15: U10.14(D15) U12#2.AA21(VOUT0_DATA15)
SoC_VOUT0_DATA16: U10.13(D16) ; off-sheet SoC_VOUT0_DATA16
SoC_VOUT0_DATA17: U10.11(D17) ; off-sheet SoC_VOUT0_DATA17
SoC_VOUT0_DATA18: U10.10(D18) ; off-sheet SoC_VOUT0_DATA18
SoC_VOUT0_DATA19: U10.9(D19) ; off-sheet SoC_VOUT0_DATA19
SoC_VOUT0_DATA20: U10.8(D20) ; off-sheet SoC_VOUT0_DATA20
SoC_VOUT0_DATA21: U10.7(D21) ; off-sheet SoC_VOUT0_DATA21
SoC_VOUT0_DATA22: U10.6(D22) ; off-sheet SoC_VOUT0_DATA22
SoC_VOUT0_DATA23: U10.4(D23) ; off-sheet SoC_VOUT0_DATA23
SoC_VOUT0_DE: U10.33(DE) U12#2.Y20(VOUT0_DE)
SoC_VOUT0_HSYNC: U10.34(HSYNC) U12#2.AB24(VOUT0_HSYNC)
SoC_VOUT0_PCLK: R60.1 U12#2.AC24(VOUT0_PCLK)
SoC_VOUT0_VSYNC: U10.35(VSYNC) U12#2.AC25(VOUT0_VSYNC)
VCC_5V0_HDMICONN: C211.1 J5.18 U50.13(5V_OUT)
VHDMI_AVCC_1V2: C229.1 C230.1 C231.1 FB3.1 U10.60(AVCC12_1) U10.66(AVCC12_2)
VHDMI_CVCC_1V2: C200.1 C207.1 C209.1 C213.1 C217.1 C225.1 FB2.1 U10.5(CVCC12_1) U10.12(CVCC12_2) U10.26(CVCC12_3) U10.42(CVCC12_4) U10.47(CVCC12_5) U10.53(CVCC12_6)
NetR41_1: R41.1 U7.1(INH)
NetR61_2: R61.2 U10.72(CI2CA)
NetR62_1: R62.1 U10.69(IO_SEL)
NetR287_2: R287.2 U10.36(SPDIF)
NetR314_1: R314.1 U50.5(LS_OE) U50.12(CT_HPD)

Not connected (* = marked no-connect by the designer): J5 14*

### Notes on the sheet
- HDMI INTERFACE
- 100E
- NOTE:
  TPD12S016PWR has integrated pullup or pulldown resistors on the
  I2C and HPD lines hence no external pullup or pulldown required.
- (near U10) I2C ADDRESS: 0x3B, 0x3F, 0x62
- (near J5) Silk: HDMI
- (in symbol AM62-EVM_BGA425, part N) VOUT0; PwrGrp:VDDSHV3
- (in symbol MISTRAL_TITLEBLK_CSIZE) Title; Designed for TI by Mistral Solutions Pvt Ltd; Size; Rev; Date:; Sheet; of

### Library data of the parts
*#41 = MISTRAL_TITLEBLK_CSIZE: Issue: 1.0; Page Create Date: March  8, 1995; Page Modify Date: *; Schematic Page Count: 44; Schematic Page Number: 41
C20 = CAP_Dup2: as C8 on sheet 37; PCB Footprint: CAP0201_0-5; Footprint Path: Y:\MIS_DATABASE\Library\ALTIUM_TOOL\PCB_FOOTPRINTS\Altium_Footprint_Lib.PcbLib; Library Path: Y:\MIS_DATABASE\Library\ALTIUM_TOOL\SCHEMATICS_PARTS\MS_DISCRETE_Library.schlib; Footprint Ref: CAP0201_0-5; Library Ref: CAP; MECHANICAL 3D STEP FILE: CAP0201_0-5; Chkd/date: MANIRAJA/230118; Crtd /date: MANIRAJA/230118; Datasheet: Y:\MIS_DATABASE\DATASHEETS\CAPACITORS\GRM033R61C104KE14.PDF; Temperature: -55°C+85°C; Weight: 0.33mg; Height: 0.33MM; Distributor_part_number: 490-14305-1-ND; Distributor_name: DIGIKEY; Package: 0201; Voltage: 16V; Tolerance: 10%
C199 C201 C230 = CAP_Dup2: as C43 on sheet 38; Footprint Ref: CAP0402_0-75; Tolerance: 20%; Voltage: 10V; Package: 0402; Distributor_name: DIGIKEY; Distributor_part_number: 490-GRM155R61A106ME11DTR-ND; Library Ref: CAP; Height: 0.55MM; Weight: 3.1mg; Temperature: -55°C+85°C; Datasheet: Y:\MIS_DATABASE\DATASHEETS\CAPACITORS\MURATA-GXX-SER_NOV17.PDF; Crtd /date: ALVY/260520; Chkd/date: MANIRAJA/300520; MECHANICAL 3D STEP FILE: CAP0402_0-75; Library Path: Y:\MIS_DATABASE\Library\ALTIUM_TOOL\SCHEMATICS_PARTS\MS_DISCRETE_Library.schlib; Footprint Path: Y:\MIS_DATABASE\Library\ALTIUM_TOOL\PCB_FOOTPRINTS\Altium_Footprint_Lib.PcbLib; PCB Footprint: CAP0402_0-75
C200 C207 C209 C212 C213 C217 C223 C225 C229 C231 = CAP_Dup2: as C145 on sheet 40; Footprint Ref: CAP0201_0-5; Tolerance: 10%; Voltage: 16V; Package: 0201; Distributor_name: DIGIKEY; Distributor_part_number: 490-14305-1-ND; Library Ref: CAP; Height: 0.33MM; Weight: 0.33mg; Temperature: -55°C+85°C; Datasheet: Y:\MIS_DATABASE\DATASHEETS\CAPACITORS\GRM033R61C104KE14.PDF; Crtd /date: MANIRAJA/230118; Chkd/date: MANIRAJA/230118; MECHANICAL 3D STEP FILE: CAP0201_0-5; Library Path: Y:\MIS_DATABASE\Library\ALTIUM_TOOL\SCHEMATICS_PARTS\MS_DISCRETE_Library.schlib; Footprint Path: Y:\MIS_DATABASE\Library\ALTIUM_TOOL\PCB_FOOTPRINTS\Altium_Footprint_Lib.PcbLib; PCB Footprint: CAP0201_0-5
C204 C211 C219 C248 = CAP_Dup2: as C146 on sheet 40; Footprint Path: Y:\MIS_DATABASE\Library\ALTIUM_TOOL\PCB_FOOTPRINTS\Altium_Footprint_Lib.PcbLib; Library Path: Y:\MIS_DATABASE\Library\ALTIUM_TOOL\SCHEMATICS_PARTS\MS_DISCRETE_Library.schlib; MECHANICAL 3D STEP FILE: CAP0402_0-75; Chkd/date: MANIRAJA/300520; Crtd /date: ALVY/260520; Datasheet: Y:\MIS_DATABASE\DATASHEETS\CAPACITORS\MURATA-GXX-SER_NOV17.PDF; Temperature: -55°C+85°C; Weight: 3.1mg; Height: 0.55MM; Library Ref: CAP; Distributor_part_number: 490-GRM155R61A106ME11DTR-ND; Distributor_name: DIGIKEY; Package: 0402; Voltage: 10V; Tolerance: 20%; Footprint Ref: CAP0402_0-75; PCB Footprint: CAP0402_0-75
C232 = CAP_Dup2: CAP CERAMIC 22uF 10V 20% X5R 0603; Mistral Part No: 120014100009-R; Mfr_name: MURATA; Mfr_part_number: GRM188R61A226ME15D; Part_type: CAPACITORS\CERAMIC; Project: TI_MAXIE_CPB; Wattage: NA; Customs_HS_Code: 85322990; Custom_Duty: 15%; PCB Footprint: CAP0603_1; Footprint Ref: CAP0603_1; Tolerance: 20%; Voltage: 10V; Package: 0603; Distributor_name: DIGIKEY; Distributor_part_number: 490-10476-1-ND; Library Ref: CAP; Height: 1.00MM; Weight: 6.3mg; Temperature: -55°C+85°C; Datasheet: Y:\MIS_DATABASE\DATASHEETS\CAPACITORS\GRM188R61A226ME15.PDF; Crtd /date: MANIRAJA/230118; Chkd/date: MANIRAJA/230118; MECHANICAL 3D STEP FILE: CAP0603_1; Library Path: Y:\MIS_DATABASE\Library\ALTIUM_TOOL\SCHEMATICS_PARTS\MS_DISCRETE_Library.schlib; Footprint Path: Y:\MIS_DATABASE\Library\ALTIUM_TOOL\PCB_FOOTPRINTS\Altium_Footprint_Lib.PcbLib
C323 = CAP_Dup2: as C45 on sheet 38; PCB Footprint: CAP0402_0-75; Footprint Path: Y:\MIS_DATABASE\Library\ALTIUM_TOOL\PCB_FOOTPRINTS\Altium_Footprint_Lib.PcbLib; Library Path: Y:\MIS_DATABASE\Library\ALTIUM_TOOL\SCHEMATICS_PARTS\MS_DISCRETE_Library.schlib; Footprint Ref: CAP0402_0-75; Library Ref: CAP; MECHANICAL 3D STEP FILE: CAP0402_0-75; Chkd/date: MANIRAJA/261020; Crtd /date: ALVY/211020; Datasheet: Y:\MIS_DATABASE\DATASHEETS\CAPACITORS\GRM155R71H104KE14.PDF; Temperature: -55°C+125°C; Weight: 3.1mg; Height: 0.55MM; Distributor_part_number: 490-10700-1-ND; Distributor_name: DIGIKEY; Package: 0402; Voltage: 50V; Tolerance: 10%
FB1 FB2 = INDUCTOR_FERRITE: IND FERRITE CHIP 300E 500mA 0603; Alternate_mfr_part_number_A: MMZ1608R301ATA00; Alternate_mfr_name_A: TDK CORPORATION; Mfr_part_number: MMZ1608R301A; Mistral Part No: 130014060028-R; Custom_Duty: 24%; Customs_HS_Code: 85437099; Wattage: NA; Project: AEGIS_POM; Chkd/date: VASANTHA/190614; Crtd /date: NAVEED/160614; Datasheet: Y:\MIS_DATABASE\DATASHEETS\DISCRETES\INDUCTORS\MMZSER.PDF; Temperature: -55°C+125°C; Weight: NA; Height: 0.75MM; Library Ref: INDUCTOR_FERRITE; Distributor_part_number_A: 445-2171-1-ND; Distributor_name_A: DIGIKEY; Distributor_part_number: 445-2171-1-ND; Distributor_name: DIGIKEY; Package: 0603; Voltage: NA; Tolerance: NA; Part_type: INDUCTOR; Mfr_name: TDK CORPORATION; PCB Footprint: IND0603
FB3 = INDUCTOR_FERRITE: IND FERRITE CHIP 300E 500mA 0603; Mistral Part No: 130014060028-R; Mfr_name: TDK CORPORATION; Mfr_part_number: MMZ1608R301A; Alternate_mfr_part_number_A: MMZ1608R301ATA00; Project: AEGIS_POM; Tolerance: NA; Customs_HS_Code: 85437099; Custom_Duty: 24%; PCB Footprint: IND0603; Part_type: INDUCTOR; Voltage: NA; Wattage: NA; Package: 0603; Distributor_name: DIGIKEY; Distributor_part_number: 445-2171-1-ND; Alternate_mfr_name_A: TDK CORPORATION; Distributor_name_A: DIGIKEY; Distributor_part_number_A: 445-2171-1-ND; Library Ref: INDUCTOR_FERRITE; Height: 0.75MM; Weight: NA; Temperature: -55°C+125°C; Datasheet: Y:\MIS_DATABASE\DATASHEETS\DISCRETES\INDUCTORS\MMZSER.PDF; Crtd /date: NAVEED/160614; Chkd/date: VASANTHA/190614
FL17 = EMIFILTER_IND: IND FERRITE BEAD CHIP 120E 2A 0402; Part_type: INDUCTOR; Mfr_part_number: BLM15PX121SN1D; Mfr_name: MURATA; Mistral Part No: 130013060022-R; Custom_Duty: 24%; Customs_HS_Code: 85369090; Wattage: NA; Tolerance: 25%; Project: GEN_3-8; Footprint Path: Y:\MIS_DATABASE\Library\ALTIUM_TOOL\PCB_FOOTPRINTS\Altium_Footprint_Lib.PcbLib; Library Path: Y:\MIS_DATABASE\Library\ALTIUM_TOOL\SCHEMATICS_PARTS\MS_FILTER_Library.schlib; MECHANICAL 3D STEP FILE: EMIFIL_BLM15A_0402_0-6; Chkd/date: NAVEED/241114; Crtd /date: USMAN/170613; Datasheet: Y:\MIS_DATABASE\DATASHEETS\DISCRETES\INDUCTORS\BLM15-SN1-SER.PDF; Temperature: -55°C+125°C; Weight: 1mg; Height: 0.55MM; Library Ref: EMIFILTER_IND; Distributor_part_number: 490-9656-1-ND; Distributor_name: DIGIKEY; Package: 0402; Voltage: NA; Footprint Ref: EMIFIL_BLM15A_0402_0-6; PCB Footprint: EMIFIL_BLM15A_0402_0-6
J5 = CON_HDMI_19X1: CON HDMI-A TYPE 1X19 0.50MM PITCH FEMALE RT SMD; Part_type: CONNECTOR\HDMI; Mfr_part_number: 10029449-001RLF; Mfr_name: FCI; Mistral Part No: 150010050001-R; Custom_Duty: 24%; Customs_HS_Code: 85369090; Wattage: NA; Project: SHIVA; Footprint Path: Y:\MIS_DATABASE\Library\ALTIUM_TOOL\PCB_FOOTPRINTS\Altium_Footprint_Lib.PcbLib; Library Path: Y:\MIS_DATABASE\Library\ALTIUM_TOOL\SCHEMATICS_PARTS\MS_CONNECTOR_Library.schlib; MECHANICAL 3D STEP FILE: CON_19X1_10029449-001RLF_S_R_S_6-3; Chkd/date: VASANTHA/060117; Crtd /date: MUDDU/060510; Datasheet: Y:\MIS_DATABASE\DATASHEETS\CONNECTORS\10029449-001RLF.PDF; Temperature: -20°C+85°C; Weight: 2700mg; Height: 6.30MM; Library Ref: CON_HDMI_19X1; Distributor_part_number: 609-1010-1-ND; Distributor_name: DIGIKEY; Package: SMD; Voltage: NA; Tolerance: NA; Footprint Ref: CON_19X1_10029449-001RLF_S_R_S_6-3; PCB Footprint: CON_19X1_10029449-001RLF_S_R_S_6-3
R34 R62 R314 = RESISTOR_Dup6: as R697 on sheet 39; PCB Footprint: RES0201_0-5; Footprint Path: Y:\MIS_DATABASE\Library\ALTIUM_TOOL\PCB_FOOTPRINTS\Altium_Footprint_Lib.PcbLib; Library Path: Y:\MIS_DATABASE\Library\ALTIUM_TOOL\SCHEMATICS_PARTS\MS_DISCRETE_Library.schlib; MECHANICAL 3D STEP FILE: RES0201_0-5; Chkd/date: NAVEED/301214; Crtd /date: MUDDU/120710; Datasheet: Y:\MIS_DATABASE\DATASHEETS\RESISTORS\RCXXXXL-SER_MAR18.PDF; Temperature: -55°C+125°C; Weight: 0.17mg; Height: 0.26MM; Library Ref: RESISTOR; Distributor_part_number: 311-0.0NCT-ND; Distributor_name: DIGIKEY; Package: 0201; Wattage: 1/20W; Tolerance: 5%; Footprint Ref: RES0201_0-5
R41 = RESISTOR_Dup6: RES 10K 1/20W 1% 0201; Mistral Part No: 110011040018-R; Mfr_name: YAGEO AMERICA; Mfr_part_number: RC0201FR-0710KL; Part_type: RESISTORS\FIXED; Project: GOLDEN-I LITE; Voltage: NA; Customs_HS_Code: 85332119; Custom_Duty: 15%; PCB Footprint: RES0201_0-5; Footprint Path: Y:\MIS_DATABASE\Library\ALTIUM_TOOL\PCB_FOOTPRINTS\Altium_Footprint_Lib.PcbLib; Library Path: Y:\MIS_DATABASE\Library\ALTIUM_TOOL\SCHEMATICS_PARTS\MS_DISCRETE_Library.schlib; Footprint Ref: RES0201_0-5; Library Ref: RESISTOR; Tolerance: 1%; Wattage: 1/20W; Package: 0201; Distributor_name: DIGIKEY; Distributor_part_number: 311-10.0KMCT-ND; Height: 0.26MM; Weight: 0.17mg; Temperature: -55°C+125°C; Datasheet: Y:\MIS_DATABASE\DATASHEETS\RESISTORS\RCXXXXL-SER_MAR18.PDF; Crtd /date: MANIRAJA/270117; Chkd/date: VASANTHA/270117; MECHANICAL 3D STEP FILE: RES0201_0-5
R60 = RESISTOR_Dup6: RES 0E 1/20W 5% 0201; Mistral Part No: 110010070067-R; Mfr_name: YAGEO AMERICA; Mfr_part_number: RC0201JR-070RL; Part_type: RESISTORS\FIXED; SIGNAL_MODEL: RESISTOR_RES0201_0-5_0E_0E; Project: PB_BUGBASE; Voltage: NA; Customs_HS_Code: 85332119; Custom_Duty: 15%; Footprint Ref: RES0201_0-5; Tolerance: 5%; Wattage: 1/20W; Package: 0201; Distributor_name: DIGIKEY; Distributor_part_number: 311-0.0NCT-ND; Library Ref: RESISTOR; Height: 0.26MM; Weight: 0.17mg; Temperature: -55°C+125°C; Datasheet: Y:\MIS_DATABASE\DATASHEETS\RESISTORS\RCXXXXL-SER_MAR18.PDF; Crtd /date: MUDDU/120710; Chkd/date: NAVEED/301214; MECHANICAL 3D STEP FILE: RES0201_0-5; Library Path: Y:\MIS_DATABASE\Library\ALTIUM_TOOL\SCHEMATICS_PARTS\MS_DISCRETE_Library.schlib; Footprint Path: Y:\MIS_DATABASE\Library\ALTIUM_TOOL\PCB_FOOTPRINTS\Altium_Footprint_Lib.PcbLib; PCB Footprint: RES0201_0-5
R61 = RESISTOR_Dup6: RES 4.7K 1/20W 5% 0201; Part_type: RESISTORS\FIXED; Mfr_part_number: RC0201JR-074K7L; Mfr_name: YAGEO AMERICA; Mistral Part No: 110021090007-R; Custom_Duty: 15%; Customs_HS_Code: 85332119; Voltage: NA; Project: TI_AM62x SKEVM_BRD; PCB Footprint: RES0201_0-5; Footprint Path: Y:\MIS_DATABASE\Library\ALTIUM_TOOL\PCB_FOOTPRINTS\Altium_Footprint_Lib.PcbLib; Library Path: Y:\MIS_DATABASE\Library\ALTIUM_TOOL\SCHEMATICS_PARTS\MS_DISCRETE_Library.schlib; MECHANICAL 3D STEP FILE: RES0201_0-5; Chkd/date: MANIRAJA/200921; Crtd /date: ALVY/200921; Datasheet: Y:\MIS_DATABASE\DATASHEETS\RESISTORS\RCXXXXL-SER_MAR18.PDF; Temperature: -55°C+125°C; Weight: 0.17mg; Height: 0.26MM; Library Ref: RESISTOR; Distributor_part_number: 311-4.7KNCT-ND; Distributor_name: DIGIKEY; Package: 0201; Wattage: 1/20W; Tolerance: 5%; Footprint Ref: RES0201_0-5
R287 = RESISTOR_Dup6: RES 0E 1/20W 5% 0201; Mistral Part No: 110010070067-R; Mfr_name: YAGEO AMERICA; Mfr_part_number: RC0201JR-070RL; Part_type: RESISTORS\FIXED; Project: PB_BUGBASE; Voltage: NA; Customs_HS_Code: 85332119; Custom_Duty: 15%; PCB Footprint: RES0201_0-5; Footprint Ref: RES0201_0-5; Tolerance: 5%; Wattage: 1/20W; Package: 0201; Distributor_name: DIGIKEY; Distributor_part_number: 311-0.0NCT-ND; Library Ref: RESISTOR; Height: 0.26MM; Weight: 0.17mg; Temperature: -55°C+125°C; Datasheet: Y:\MIS_DATABASE\DATASHEETS\RESISTORS\RCXXXXL-SER_MAR18.PDF; Crtd /date: MUDDU/120710; Chkd/date: NAVEED/301214; MECHANICAL 3D STEP FILE: RES0201_0-5; Library Path: Y:\MIS_DATABASE\Library\ALTIUM_TOOL\SCHEMATICS_PARTS\MS_DISCRETE_Library.schlib; Footprint Path: Y:\MIS_DATABASE\Library\ALTIUM_TOOL\PCB_FOOTPRINTS\Altium_Footprint_Lib.PcbLib
R316 R323 = RESISTOR_Dup6: RES 2.2K 1/16W 5% 0402; Mistral Part No: 110010120018-R; Mfr_name: VISHAY; Mfr_part_number: CRCW04022K20JNED; Part_type: RESISTORS\FIXED; Project: AEGIS_POM; Voltage: NA; Customs_HS_Code: 85332119; Custom_Duty: 15%; PCB Footprint: RES0402_0-5; Footprint Ref: RES0402_0-5; Tolerance: 5%; Wattage: 1/16W; Package: 0402; Distributor_name: DIGIKEY; Distributor_part_number: 541-2.2KJCT-ND; Library Ref: RESISTOR; Height: 0.40MM; Weight: 0.65mg; Temperature: -55°C+155°C; Datasheet: Y:\MIS_DATABASE\DATASHEETS\RESISTORS\CRCW0603.PDF; Crtd /date: VASANTHA/240614; Chkd/date: NAVEED/150714; MECHANICAL 3D STEP FILE: RES0402_0-5; Library Path: Y:\MIS_DATABASE\Library\ALTIUM_TOOL\SCHEMATICS_PARTS\MS_DISCRETE_Library.schlib; Footprint Path: Y:\MIS_DATABASE\Library\ALTIUM_TOOL\PCB_FOOTPRINTS\Altium_Footprint_Lib.PcbLib
R325 R373 R389 R390 = RESISTOR_Dup6: as R16 on sheet 37; PCB Footprint: RES0201_0-5; Footprint Path: Y:\MIS_DATABASE\Library\ALTIUM_TOOL\PCB_FOOTPRINTS\Altium_Footprint_Lib.PcbLib; Library Path: Y:\MIS_DATABASE\Library\ALTIUM_TOOL\SCHEMATICS_PARTS\MS_DISCRETE_Library.schlib; MECHANICAL 3D STEP FILE: RES0201_0-5; Chkd/date: MANIRAJA/050517; Crtd /date: MANIRAJA/050517; Datasheet: Y:\MIS_DATABASE\DATASHEETS\RESISTORS\RCXXXXL-SER_MAR18.PDF; Temperature: -55°C+125°C; Weight: 0.17mg; Height: 0.26MM; Library Ref: RESISTOR; Distributor_part_number: 311-10KNCT-ND; Distributor_name: DIGIKEY; Package: 0201; Wattage: 1/20W; Tolerance: 5%; Footprint Ref: RES0201_0-5
R326 = RESISTOR_Dup6: RES 10K 1/16W 5% 0402; Part_type: RESISTORS\FIXED; Mfr_part_number: CRCW040210K0JNED; Mfr_name: VISHAY; Mistral Part No: 110011060021-R; Custom_Duty: 15%; Customs_HS_Code: 85332119; Voltage: NA; Project: NEXTNAV_ORBIT_MODULE; Footprint Path: Y:\MIS_DATABASE\Library\ALTIUM_TOOL\PCB_FOOTPRINTS\Altium_Footprint_Lib.PcbLib; Library Path: Y:\MIS_DATABASE\Library\ALTIUM_TOOL\SCHEMATICS_PARTS\MS_DISCRETE_Library.schlib; MECHANICAL 3D STEP FILE: RES0402_0-5; Chkd/date: MANIRAJA/120219; Crtd /date: MANIRAJA/120219; Datasheet: Y:\MIS_DATABASE\DATASHEETS\RESISTORS\CRCW0603.PDF; Temperature: -55°C+155°C; Weight: 0.65mg; Height: 0.40MM; Library Ref: RESISTOR; Distributor_part_number: 541-10KJCT-ND; Distributor_name: DIGIKEY; Package: 0402; Wattage: 1/16W; Tolerance: 5%; Footprint Ref: RES0402_0-5; PCB Footprint: RES0402_0-5
R327 = RESISTOR_Dup6: RES 4.3K 1/16W 1% 0402; Part_type: RESISTORS\FIXED; Mfr_part_number: RC0402FR-074K3L; Mfr_name: YAGEO AMERICA; Mistral Part No: 110016060004-R; Custom_Duty: 15%; Customs_HS_Code: 85332119; Voltage: NA; Project: TMDXCSKCC; Footprint Path: Y:\MIS_DATABASE\Library\ALTIUM_TOOL\PCB_FOOTPRINTS\Altium_Footprint_Lib.PcbLib; Library Path: Y:\MIS_DATABASE\Library\ALTIUM_TOOL\SCHEMATICS_PARTS\MS_DISCRETE_Library.schlib; MECHANICAL 3D STEP FILE: RES0402_0-5; Chkd/date: VASANTHA/140616; Crtd /date: VASANTHA/140616; Datasheet: Y:\MIS_DATABASE\DATASHEETS\RESISTORS\RCXXXXL-SER_MAR18.PDF; Temperature: -55°C+155°C; Weight: 0.65mg; Height: 0.40MM; Library Ref: RESISTOR; Distributor_part_number: 311-4.30KLRCT-ND; Distributor_name: DIGIKEY; Package: 0402; Wattage: 1/16W; Tolerance: 1%; Footprint Ref: RES0402_0-5; PCB Footprint: RES0402_0-5
TP14 TP16 TP18 TP88 = TESTPOINT: as TP50 on sheet 40; PCB Footprint: TP20_SMD; Customs_HS_Code: NA; RoHS: NA; Footprint Ref: TP20_SMD; Library Ref: TESTPOINT; Footprint Path: Y:\MIS_DATABASE\Library\ALTIUM_TOOL\PCB_FOOTPRINTS\Altium_Footprint_Lib.PcbLib; Library Path: Y:\MIS_DATABASE\Library\ALTIUM_TOOL\SCHEMATICS_PARTS\MS_DISCRETE_Library.schlib; MECHANICAL 3D STEP FILE: NA; Datasheet: NA; Temperature: NA; Weight: NA; Wattage: NA; Voltage: NA; Tolerance: NA; Chkd/date: SHREESHAIL/171006; Crtd /date: MAZHAR/171006; Height: NA; Distributor_part_number: NA; Distributor_name: NA; Package: SMD; Part_type: TESTPOINT; Mfr_part_number: TP20_SMD; Mistral Part No: NA
U7 = OSC_KC2016K: OSC 12.288MHz CMOS SMD; Mistral Part No: 130021100008-R; Mfr_name: KYOCERA; Mfr_part_number: KC2520Z12.2880C1KX00; Part_type: OSCILLATORS; Project: TI_AM62x SKEVM_BRD; Tolerance: NA; Customs_HS_Code: 85437099; Custom_Duty: 24%; PCB Footprint: OSC4_KC2520B_100X80_SMD_0-8; Footprint Ref: OSC4_KC2520B_100X80_SMD_0-8; Voltage: NA; Wattage: NA; Package: SMD; Distributor_name: DIGIKEY; Distributor_part_number: 1253-KC2520Z12.2880C1KX00CT-ND; Library Ref: OSC_KC2016K; Height: 0.80MM; Weight: NA; Temperature: -40°C+85°C; Datasheet: Y:\MIS_DATABASE\DATASHEETS\MISC\CRY_OSC\KC-Z-SERPDF; Crtd /date: ALVY/061021; Chkd/date: MANIRAJA/061021; MECHANICAL 3D STEP FILE: OSC4_KC2520B_100X80_SMD_0-8; Library Path: Y:\MIS_DATABASE\Library\ALTIUM_TOOL\SCHEMATICS_PARTS\MS_DISCRETE_Library.schlib; Footprint Path: Y:\MIS_DATABASE\Library\ALTIUM_TOOL\PCB_FOOTPRINTS\Altium_Footprint_Lib.PcbLib
U10 = SII9022ACNU_QFN72: IC HDMI TRANSMITTER QFN72; Part_type: ICS\DIGITAL\PERIPHERAL; Mfr_name: SILICON IMAGE; Mistral Part No: 141010060001; Custom_Duty: 15%; Customs_HS_Code: 85423100; Wattage: NA; Project: CENTAURUS; PCB Footprint: QFN72_19-68_390X390_0-9; Footprint Path: Y:\MIS_DATABASE\Library\ALTIUM_TOOL\PCB_FOOTPRINTS\Altium_Footprint_Lib.PcbLib; Library Path: Y:\MIS_DATABASE\Library\ALTIUM_TOOL\SCHEMATICS_PARTS\MS_COMBINATIONAL_Library.schlib; MECHANICAL 3D STEP FILE: QFN72_19-68_390X390_0-9; RoHS: NA; Chkd/date: MANIRAJA/270818; Crtd /date: MUDDU/310510; Datasheet: Y:\MIS_DATABASE\DATASHEETS\ICS\DIGITAL\PERIPHERAL\SiI9022.PDF; Temperature: -20°C+85°C; Weight: NA; Height: 0.90MM; Library Ref: SiI9022ACNU_QFN72; Distributor_part_number: NA; Distributor_name: NA; Package: QFN72; Voltage: NA; Tolerance: NA; Mfr_part_number: SiI9022ACNU; Footprint Ref: QFN72_19-68_390X390_0-9
U12#2 = AM62-EVM_BGA425: as U12#2 on sheet 37; Mfr_part_number: AM62 SoC_EVM; Voltage: NA; Wattage: NA; Package: BGA425; Distributor_name: NA; Distributor_part_number: NA; Library Ref: AM62-EVM_BGA425; Footprint Ref: BGA425_19-68_510X510_0-7; Height: 0.65MM; Weight: NA; Temperature: NA; Datasheet: Y:\MIS_DATABASE\DATASHEETS\ICS\DIGITAL\MICROCONTROLLER\AM62-SoC_SVB.PDF; Crtd /date: MANIRAJA/110621; Chkd/date: ALVY/110621; RoHS: NA; MECHANICAL 3D STEP FILE: BGA425_19-68_510X510_0-7; Library Path: Y:\MIS_DATABASE\Library\ALTIUM_TOOL\SCHEMATICS_PARTS\MS_MICROPROCESSOR_Library.schlib; Footprint Path: Y:\MIS_DATABASE\Library\ALTIUM_TOOL\PCB_FOOTPRINTS\Altium_Footprint_Lib.PcbLib; PCB Footprint: BGA425_19-68_510X510_0-7
U50 = TPD12S016PW_TSSOP24: IC HDMI COMPANION CHIP WITH I2C LEVEL SHIFTING,12-CH ESD TSSOP24; Manufacturer: Texas Instruments; Mistral Part No: 141011080021-R; Part_type: ICS\INTERFACE; P/N: TPD12S015; TN: 111-1002513; OriginalSymbolOrigin: (0,0); Project: DM385EVM_BASE-BOARD; Tolerance: NA; Customs_HS_Code: 85423100; Custom_Duty: 15%; PCB Footprint: TSSOP24_25-59_315X180_1-2; Mfr_name: TEXAS INSTRUMENTS; Mfr_part_number: TPD12S016PWR; Voltage: NA; Wattage: NA; Package: TSSOP24; Distributor_name: DIGIKEY; Distributor_part_number: 296-29690-1-ND; Library Ref: TPD12S016PW_TSSOP24; Height: 1.20MM; Weight: 212mg; Temperature: -40°C+85°C; Datasheet: Y:\MIS_DATABASE\DATASHEETS\ICS\INTERFACE\TPD12S016.PDF; Crtd /date: BAVISH/180811; Chkd/date: MANIRAJA/110917; MECHANICAL 3D STEP FILE: TSSOP24_25-59_315X180_1-2
U54 = SN74LVC1G08DBVRE4_SOT23-5_Dup1: IC SINGLE 2-INPUT POSITIVE AND GATE SOT23-5; Mistral Part No: 141009060026-R; Mfr_name: TEXAS INSTRUMENTS; Part_type: ICS\DIGITAL\GATES; Project: KHAN_MAIN; Customs_HS_Code: 85423100; Custom_Duty: 15%; PCB Footprint: SOT23-5; Mfr_part_number: SN74LVC1G08DBVRE4; Package: SOT23-5; Distributor_name: DIGIKEY; Distributor_part_number: SN74LVC1G08DBVRE4-ND; Library Ref: SN74LVC1G08DBVRE4_SOT23-5; Height: 1.45MM; Temperature: -40°C+85°C; Datasheet: Y:\MIS_DATABASE\DATASHEETS\ICS\DIGITAL\GATES\SN74LVC1G08.PDF; Crtd /date: USMAN/151008; Chkd/date: SUHAS/221010; RoHS: Sb/ Br FREE